# EAGLE design STEPDUINO (EAGLE 6.5.0)
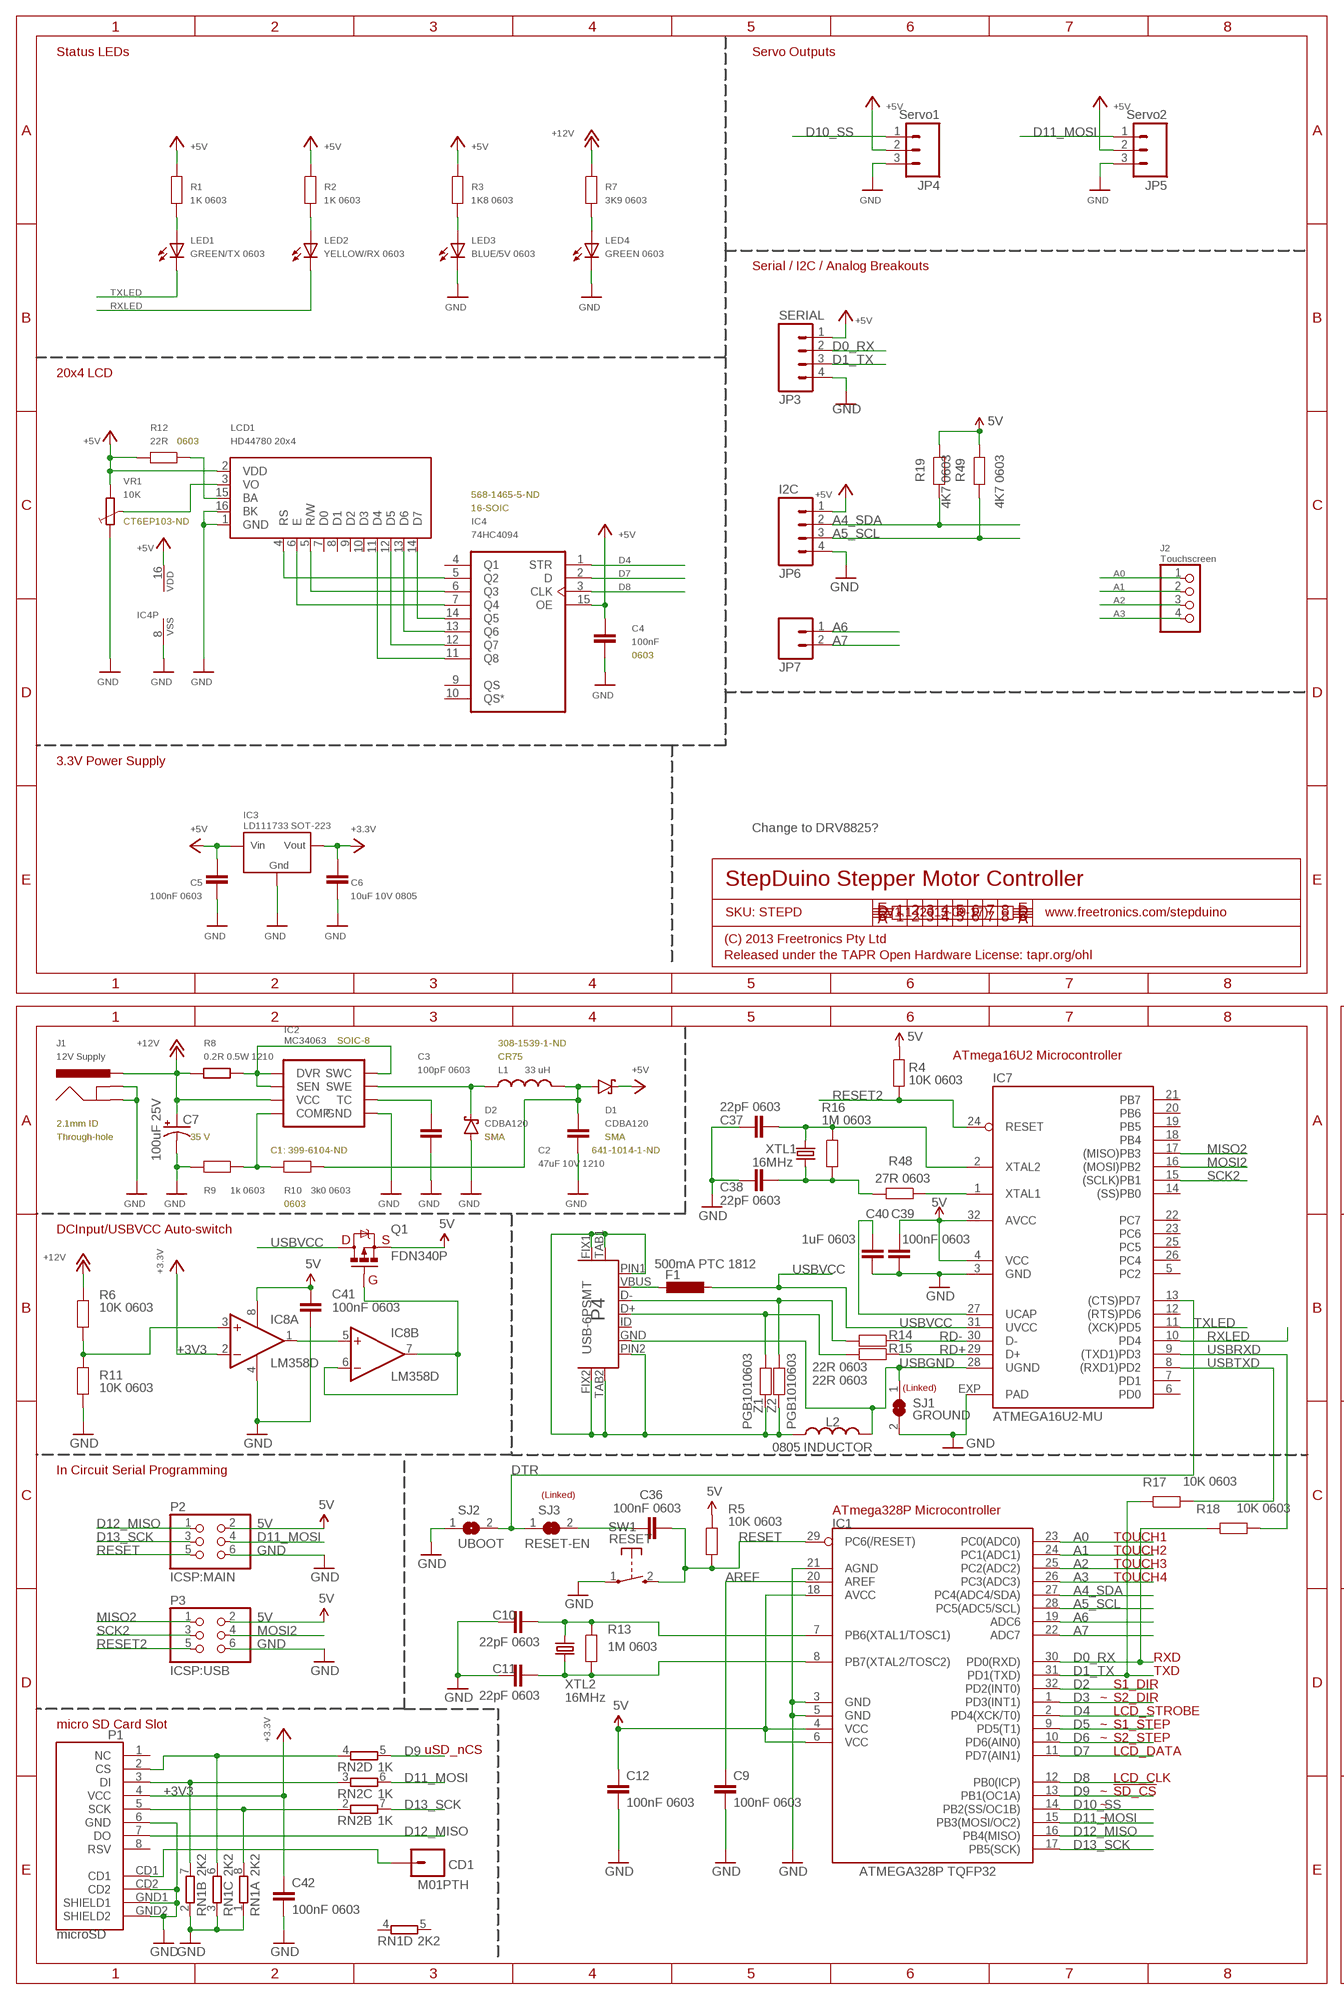
[diagram p0: schematic, sheet 1, part 1 of 2]
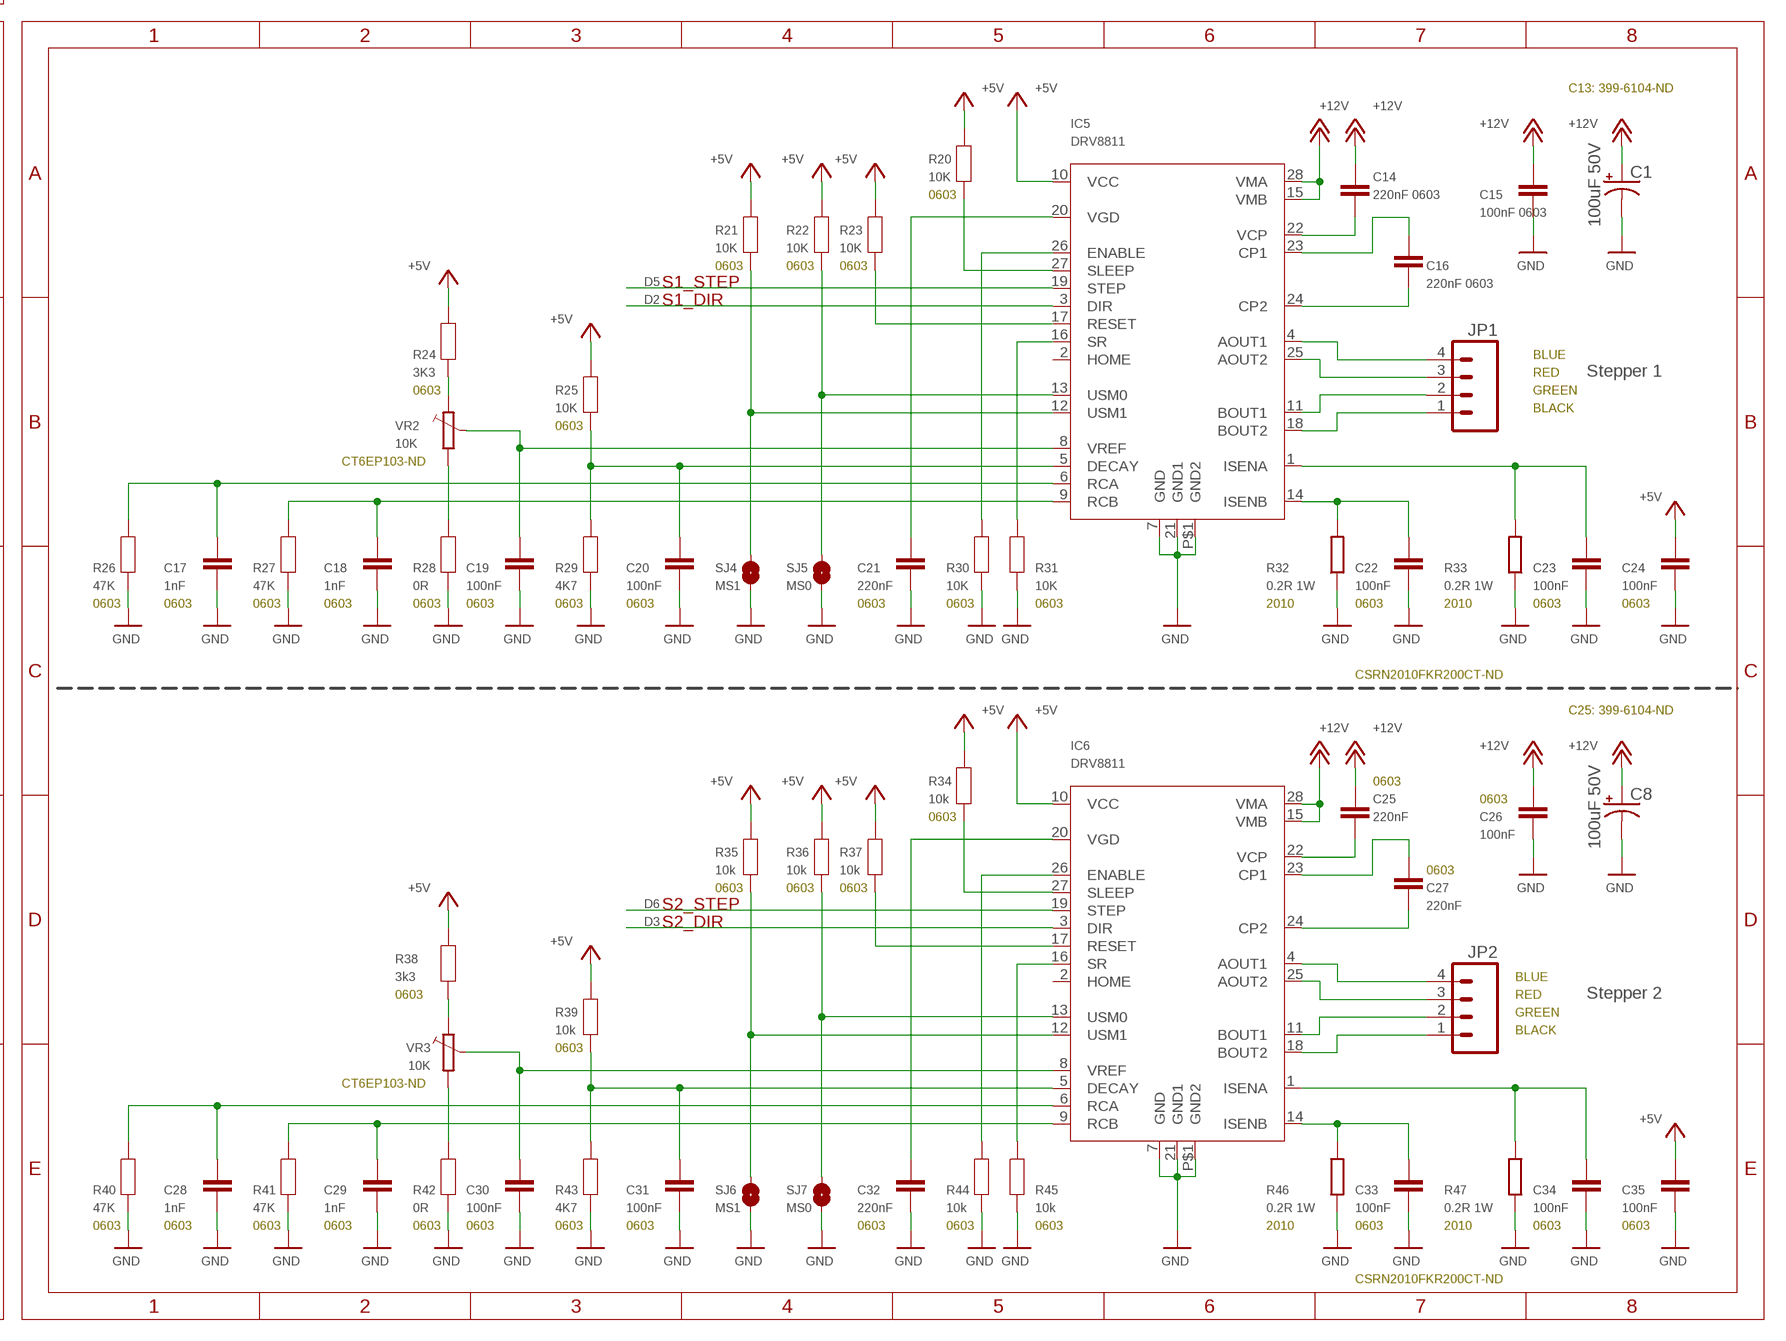
[diagram p1: schematic, sheet 1, part 2 of 2]

## Parts
C1  100uF 50V  CAP_POLE  [PANASONIC_E]
C2  47uF 10V 1210  C-EUC1210  [C1210]
C3  100pF 0603  CAP0603  [0603]
C4  100nF  CAP0603  [0603]
C5  100nF 0603  CAP0603  [0603]
C6  10uF 10V 0805  CAP0805  [0805]
C7  100uF 25V  CAP_POLE  [PANASONIC_E]
C8  100uF 50V  CAP_POLE  [PANASONIC_E]
C9  100nF 0603  CAP0603  [0603]
C10  22pF 0603  CAP0603  [0603]
C11  22pF 0603  CAP0603  [0603]
C12  100nF 0603  CAP0603  [0603]
C14  220nF 0603  CAP0603  [0603]
C15  100nF 0603  CAP0603  [0603]
C16  220nF 0603  CAP0603  [0603]
C17  1nF  CAP0603  [0603]
C18  1nF  CAP0603  [0603]
C19  100nF  CAP0603  [0603]
C20  100nF  CAP0603  [0603]
C21  220nF  CAP0603  [0603]
C22  100nF  CAP0603  [0603]
C23  100nF  CAP0603  [0603]
C24  100nF  CAP0603  [0603]
C25  220nF  CAP0603  [0603]
C26  100nF  CAP0603  [0603]
C27  220nF  CAP0603  [0603]
C28  1nF  CAP0603  [0603]
C29  1nF  CAP0603  [0603]
C30  100nF  CAP0603  [0603]
C31  100nF  CAP0603  [0603]
C32  220nF  CAP0603  [0603]
C33  100nF  CAP0603  [0603]
C34  100nF  CAP0603  [0603]
C35  100nF  CAP0603  [0603]
C36  100nF 0603  CAP0603  [0603]
C37  22pF 0603  CAP0603  [0603]
C38  22pF 0603  CAP0603  [0603]
C39  100nF 0603  CAP0603  [0603]
C40  1uF 0603  CAP0603  [0603]
C41  100nF 0603  CAP0603  [0603]
C42  100nF 0603  CAP0603  [0603]
CD1  M01PTH  [1X01]
D1  CDBA120  SCHOTTKY  [SMA]
D2  CDBA120  SCHOTTKY  [SMA]
F1  500mA PTC 1812  L-EUL1812  [L1812]
IC1  ATMEGA328P TQFP32  AVR-MEGA8-AI  [TQFP32-08]
IC2  MC34063  MC34063SMD  [SO08]
IC3  LD111733 SOT-223  REG1117  [SOT223]
IC4  74HC4094  4094D  [SO16@1]
IC5  DRV8811  [HTSSOP28]
IC6  DRV8811  [HTSSOP28]
IC7  ATMEGA16U2-MU  ATMEL_ATMEGA8U2-MUQFN  [ATMEL_QFN32]
IC8  LM358D  [SO08]
J1  12V Supply  POWER_JACKPTH  [POWER_JACK_PTH]
J2  Touchscreen  PINHD-1X4  [1X04]
JP1  M04SCREW  [SCREWTERMINAL-3.5MM-4]
JP2  M04SCREW  [SCREWTERMINAL-3.5MM-4]
JP3  SERIAL  M04PTH  [1X04]
JP4  Servo1  M03PTH  [1X03]
JP5  Servo2  M03PTH  [1X03]
JP6  I2C  M04PTH  [1X04]
JP7  M02PTH  [1X02]
L1  33 uH  INDUCTORCR75  [CR75]
L2  0805 INDUCTOR  INDUCTOR0805-LARGE  [0805-LARGE]
LCD1  HD44780 20x4  HDM20416L  [HDM20416L]
LED1  GREEN/TX 0603  LED0603  [LED-0603]
LED2  YELLOW/RX 0603  LED0603  [LED-0603]
LED3  BLUE/5V 0603  LED0603  [LED-0603]
LED4  GREEN 0603  LED0603  [LED-0603]
P1  microSD  USD-SOCKETNEW  [MICRO-SD-SOCKET-PP]
P2  ICSP:MAIN  PINHD-2X3  [2X03]
P3  ICSP:USB  PINHD-2X3  [2X03]
P4  USB-6PSMT  [USB-MICROB-MB05PMXX]
Q1  FDN340P  MOSFET-PCHANNEL  [SOT23]
R1  1K 0603  RESISTOR0603  [0603]
R2  1K 0603  RESISTOR0603  [0603]
R3  1K8 0603  RESISTOR0603  [0603]
R4  10K 0603  RESISTOR0603  [0603]
R5  10K 0603  RESISTOR0603  [0603]
R6  10K 0603  RESISTOR0603  [0603]
R7  3K9 0603  RESISTOR0603  [0603]
R8  0.2R 0.5W 1210  R-EU_R1210  [R1210]
R9  1k 0603  RESISTOR0603  [0603]
R10  3k0 0603  RESISTOR0603  [0603]
R11  10K 0603  RESISTOR0603  [0603]
R12  22R  RESISTOR0603  [0603]
R13  1M 0603  RESISTOR0603  [0603]
R14  22R 0603  RESISTOR0603  [0603]
R15  22R 0603  RESISTOR0603  [0603]
R16  1M 0603  RESISTOR0603  [0603]
R17  10K 0603  RESISTOR0603  [0603@1]
R18  10K 0603  RESISTOR0603  [0603@1]
R19  4K7 0603  RESISTOR0603  [0603]
R20  10K  RESISTOR0603  [0603]
R21  10K  RESISTOR0603  [0603]
R22  10K  RESISTOR0603  [0603]
R23  10K  RESISTOR0603  [0603]
R24  3K3  RESISTOR0603  [0603]
R25  10K  RESISTOR0603  [0603]
R26  47K  RESISTOR0603  [0603]
R27  47K  RESISTOR0603  [0603]
R28  0R  RESISTOR0603  [0603]
R29  4K7  RESISTOR0603  [0603]
R30  10K  RESISTOR0603  [0603]
R31  10K  RESISTOR0603  [0603]
R32  0.2R 1W  R-EU_R2010  [R2010]
R33  0.2R 1W  R-EU_R2010  [R2010]
R34  10k  RESISTOR0603  [0603]
R35  10k  RESISTOR0603  [0603]
R36  10k  RESISTOR0603  [0603]
R37  10k  RESISTOR0603  [0603]
R38  3k3  RESISTOR0603  [0603]
R39  10k  RESISTOR0603  [0603]
R40  47K  RESISTOR0603  [0603]
R41  47K  RESISTOR0603  [0603]
R42  0R  RESISTOR0603  [0603]
R43  4K7  RESISTOR0603  [0603]
R44  10k  RESISTOR0603  [0603]
R45  10k  RESISTOR0603  [0603]
R46  0.2R 1W  R-EU_R2010  [R2010]
R47  0.2R 1W  R-EU_R2010  [R2010]
R48  27R 0603  RESISTOR0603  [0603]
R49  4K7 0603  RESISTOR0603  [0603]
RN1  2K2  4R-NCAY16  [CAY16]
RN2  1K  4R-NCAY16  [CAY16]
SJ1  GROUND  SJCN  [SJC]
SJ2  UBOOT  SJ  [SJ]
SJ3  RESET-EN  SJCN  [SJC]
SJ4  MS1  SJ  [SJ]
SJ5  MS0  SJ  [SJ]
SJ6  MS1  SJ  [SJ]
SJ7  MS0  SJ  [SJ]
SW1  RESET  TAC_SWITCH_2PIN  [TACTILE_SWITCH_SMD_2PIN_TINY]
VR1  10K  TRIM_EU-CT6  [CT6]
VR2  10K  TRIM_EU-CT6  [CT6]
VR3  10K  TRIM_EU-CT6  [CT6]
XTL1  16MHz  CRYSTALHC49UV  [HC49U-V]
XTL2  16MHz  CRYSTALHC49UV  [HC49U-V]
Z1  PGB1010603  RESISTOR0603  [0603]
Z2  PGB1010603  RESISTOR0603  [0603]

## Nets
5V: C4.1 C5.1 C12.1 C24.1 C35.1 C39.1 C41.1 D1.K IC1.4(VCC) IC1.6(VCC) IC1.18(AVCC) IC3.3(VIN) IC4.15(OE) IC4.16(VDD) IC5.10(VCC) IC6.10(VCC) IC7.4(VCC) IC7.32(AVCC) IC8.8(P:V+) JP3.1 JP4.2 JP5.2 JP6.1 LCD1.2(VDD) P2.2 P3.2 Q1.2(S) R1.2 R2.2 R3.2 R4.2 R5.2 R12.2 R19.2 R20.2 R21.2 R22.2 R23.2 R24.2 R25.2 R34.2 R35.2 R36.2 R37.2 R38.2 R39.2 R49.2 VR1.A ; supply symbol labelled +5V
+3V3: C6.1 C42.1 IC3.2(VOUT) IC8.2(A:-IN) P1.4(VCC) ; supply symbol labelled +3.3V
+12V: C1.+ C7.+ C8.+ C14.1 C15.1 C25.1 C26.1 IC2.6(VCC) IC5.15(VMB) IC5.28(VMA) IC6.15(VMB) IC6.28(VMA) J1.PWR R6.2 R7.2 R8.1
A0: IC1.23(PC0(ADC0)) J2.1
A1: IC1.24(PC1(ADC1)) J2.2
A2: IC1.25(PC2(ADC2)) J2.3
A3: IC1.26(PC3(ADC3)) J2.4
A4_SDA: IC1.27(PC4(ADC4/SDA)) JP6.2 R19.1
A5_SCL: IC1.28(PC5(ADC5/SCL)) JP6.3 R49.1
A6: IC1.19(ADC6) JP7.1
A7: IC1.22(ADC7) JP7.2
AREF: C9.1 IC1.20(AREF)
D0_RX: IC1.30(PD0(RXD)) JP3.2 R18.1
D1_TX: IC1.31(PD1(TXD)) JP3.3 R17.1
D2: IC1.32(PD2(INT0)) IC5.3(DIR)
D3: IC1.1(PD3(INT1)) IC6.3(DIR)
D4: IC1.2(PD4(XCK/T0)) IC4.1(STR)
D5: IC1.9(PD5(T1)) IC5.19(STEP)
D6: IC1.10(PD6(AIN0)) IC6.19(STEP)
D7: IC1.11(PD7(AIN1)) IC4.2(D)
D8: IC1.12(PB0(ICP)) IC4.3(CLK)
D9: IC1.13(PB1(OC1A)) RN2.5
D10_SS: IC1.14(PB2(SS/OC1B)) JP4.1
D11_MOSI: IC1.15(PB3(MOSI/OC2)) JP5.1 P2.4 RN2.6
D12_MISO: IC1.16(PB4(MISO)) P1.7(DO) P2.1
D13_SCK: IC1.17(PB5(SCK)) P2.3 RN2.7
DTR: IC7.13((CTS)PD7) SJ2.2 SJ3.1
GND: C1.- C2.2 C3.2 C4.2 C5.2 C6.2 C7.- C8.- C9.2 C10.1 C11.1 C12.2 C15.2 C17.2 C18.2 C19.2 C20.2 C21.2 C22.2 C23.2 C24.2 C26.2 C28.2 C29.2 C30.2 C31.2 C32.2 C33.2 C34.2 C35.2 C37.1 C38.1 C39.2 C40.2 C41.2 C42.2 D2.A IC1.3(GND) IC1.5(GND) IC1.21(AGND) IC2.4(GND) IC3.1(GND) IC4.8(VSS) IC5.7(GND) IC5.21(GND1) IC5.P$1(GND2) IC6.7(GND) IC6.21(GND1) IC6.P$1(GND2) IC7.3(GND) IC7.EXP(PAD) IC8.4(P:V-) J1.GND J1.GNDBREAK JP3.4 JP4.3 JP5.3 JP6.4 LCD1.1(GND) LCD1.16(BK) LED3.C LED4.C P1.6(GND) P1.CD2 P1.GND1(SHIELD1) P1.GND2(SHIELD2) P2.6 P3.6 R9.2 R11.1 R26.1 R27.1 R28.1 R29.1 R30.1 R31.1 R32.1 R33.1 R40.1 R41.1 R42.1 R43.1 R44.1 R45.1 R46.1 R47.1 RN1.1 RN1.2 RN1.3 SJ1.2 SJ2.1 SJ4.1 SJ5.1 SJ6.1 SJ7.1 SW1.1(P) VR1.E
MISO2: IC7.17((MISO)PB3) P3.1
MOSI2: IC7.16((MOSI)PB2) P3.4
N$1: IC6.11(BOUT1) JP2.2
N$3: IC5.4(AOUT1) JP1.4
N$4: IC6.18(BOUT2) JP2.1
N$6: IC6.25(AOUT2) JP2.3
N$7: C27.2 IC6.24(CP2)
N$8: C27.1 IC6.23(CP1)
N$9: C25.2 IC6.22(VCP)
N$10: C32.1 IC6.20(VGD)
N$11: C10.2 IC1.7(PB6(XTAL1/TOSC1)) R13.2 XTL2.2
N$13: C34.1 IC6.1(ISENA) R47.2
N$14: C33.1 IC6.14(ISENB) R46.2
N$15: C31.1 IC6.5(DECAY) R39.1 R43.2
N$16: C28.1 IC6.6(RCA) R40.2
N$17: C16.2 IC5.24(CP2)
N$18: C16.1 IC5.23(CP1)
N$19: IC5.16(SR) R31.2
N$20: C29.1 IC6.9(RCB) R41.2
N$21: IC5.18(BOUT2) JP1.1
N$22: IC5.11(BOUT1) JP1.2
N$23: IC5.25(AOUT2) JP1.3
N$24: C14.2 IC5.22(VCP)
N$25: C20.1 IC5.5(DECAY) R25.1 R29.2
N$26: C21.1 IC5.20(VGD)
N$27: C17.1 IC5.6(RCA) R26.2
N$28: C11.2 IC1.8(PB7(XTAL2/TOSC2)) R13.1 XTL2.1
N$29: LED3.A R3.1
N$30: LED2.A R2.1
N$31: LED1.A R1.1
N$32: IC2.1(SWC) IC2.7(SEN) IC2.8(DVR) R8.2
N$36: IC7.1(XTAL1) R48.1
N$37: L2.1 P4.FIX1 P4.FIX2 P4.PIN1 P4.PIN2 P4.TAB1 P4.TAB2 Z1.2 Z2.2
N$38: P4.D+ R15.2 Z1.1
N$40: P4.D- R14.2 Z2.1
N$42: LED4.A R7.1
N$43: C3.1 IC2.3(TC)
N$44: IC2.5(COMP) R9.1 R10.2
N$45: D2.K IC2.2(SWE) L1.P$1
N$46: C23.1 IC5.1(ISENA) R33.2
N$47: C22.1 IC5.14(ISENB) R32.2
N$48: C18.1 IC5.9(RCB) R27.2
N$49: IC5.27(SLEEP) R20.1
N$50: IC4.5(Q2) LCD1.4(RS)
N$51: IC4.6(Q3) LCD1.5(R/W)
N$52: IC4.7(Q4) LCD1.6(E)
N$53: IC4.11(Q8) LCD1.11(D4)
N$54: IC4.12(Q7) LCD1.12(D5)
N$55: IC4.13(Q6) LCD1.13(D6)
N$56: IC4.14(Q5) LCD1.14(D7)
N$57: IC5.17(RESET) R23.1
N$58: LCD1.3(VO) VR1.S
N$59: LCD1.15(BA) R12.1
N$60: R24.1 VR2.E
N$61: R28.2 VR2.A
N$62: IC8.3(A:+IN) R6.1 R11.2
N$63: IC8.6(B:-IN) IC8.7(B:OUT) Q1.1(G)
N$64: C19.1 IC5.8(VREF) VR2.S
N$65: IC5.26(ENABLE) R30.2
N$66: IC5.12(USM1) R21.1 SJ4.2
N$67: IC5.13(USM0) R22.1 SJ5.2
N$68: IC6.27(SLEEP) R34.1
N$69: IC6.17(RESET) R37.1
N$70: R38.1 VR3.E
N$71: R42.2 VR3.A
N$72: C30.1 IC6.8(VREF) VR3.S
N$73: IC6.26(ENABLE) R44.2
N$74: IC6.12(USM1) R35.1 SJ6.2
N$75: IC6.13(USM0) R36.1 SJ7.2
N$76: IC6.16(SR) R45.2
N$77: IC6.4(AOUT1) JP2.4
N$81: IC8.1(A:OUT) IC8.5(B:+IN)
N$82: P1.2(CS) RN1.6 RN2.4
N$83: P1.3(DI) RN1.7 RN2.3
N$84: P1.5(SCK) RN1.8 RN2.2
N$87: CD1.1 P1.CD1
N$90: C36.1 SJ3.2
N$113: C37.2 IC7.2(XTAL2) R16.2 XTL1.2
N$114: C38.2 R16.1 R48.2 XTL1.1
N$115: F1.1 P4.VBUS
N$117: C40.1 IC7.27(UCAP)
RD+: IC7.29(D+) R15.1
RD-: IC7.30(D-) R14.1
REG_5V: C2.1 D1.A L1.P$2 R10.1
RESET: C36.2 IC1.29(PC6(/RESET)) P2.5 R5.1 SW1.2(S)
RESET2: IC7.24(RESET) P3.5 R4.1
RXLED: IC7.10(PD4) LED2.C
SCK2: IC7.15((SCLK)PB1) P3.3
TXLED: IC7.11((XCK)PD5) LED1.C
USBGND: IC7.28(UGND) L2.2 P4.GND SJ1.1
USBRXD: IC7.9((TXD1)PD3) R18.2
USBTXD: IC7.8((RXD1)PD2) R17.2
USBVCC: F1.2 IC7.31(UVCC) Q1.3(D)
Unconnected: IC4.4(Q1) IC4.9(QS) IC4.10(QS*) IC5.2(HOME) IC6.2(HOME) IC7.5(PC2) IC7.6(PD0) IC7.7(PD1) IC7.12((RTS)PD6) IC7.14((SS)PB0) IC7.18(PB4) IC7.19(PB5) IC7.20(PB6) IC7.21(PB7) IC7.22(PC7) IC7.23(PC6) IC7.25(PC5) IC7.26(PC4) LCD1.7(D0) LCD1.8(D1) LCD1.9(D2) LCD1.10(D3) P1.1(NC) P1.8(RSV) P4.ID RN1.4 RN1.5 RN2.1 RN2.8

## Notes on the sheet
- Status LEDs | Servo Outputs
- Serial / I2C / Analog Breakouts
- 20x4 LCD
- 0603
- 568-1465-5-ND
- 16-SOIC
- CT6EP103-ND
- 0603
- 3.3V Power Supply
- Change to DRV8825?
- StepDuino Stepper Motor Controller
- SKU: STEPD | V1.1 (2013-09-17) | www.freetronics.com/stepduino
- (C) 2013 Freetronics Pty Ltd
- Released under the TAPR Open Hardware License: tapr.org/ohl
- SOIC-8 | 308-1539-1-ND
- CR75 | ATmega16U2 Microcontroller | C13: 399-6104-ND
- 2.1mm ID
- Through-hole | 35 V | SMA | SMA | 0603
- C1: 399-6104-ND | 641-1014-1-ND
- 0603 | 0603 | 0603
- 0603 | S1_STEP
- S1_DIR
- DCInput/USBVCC Auto-switch
- D | S
- BLUE
- RED | Stepper 1
- G | 0603 | GREEN
- BLACK
- 0603
- CT6EP103-ND
- (Linked)
- 0603 | 0603 | 0603 | 0603 | 0603 | 0603 | 0603 | 0603 | 0603 | 0603 | 0603 | 2010 | 0603 | 2010 | 0603 | 0603
- In Circuit Serial Programming
- (Linked)
- CSRN2010FKR200CT-ND
- ATmega328P Microcontroller
- C25: 399-6104-ND
- TOUCH1
- TOUCH2
- TOUCH3
- TOUCH4 | 0603
- 0603
- 0603
- 0603
- RXD | 0603 | 0603 | 0603
- TXD | S2_STEP
- S1_DIR | S2_DIR
- ~ | S2_DIR
- LCD_STROBE
- micro SD Card Slot | ~ | S1_STEP | BLUE
- ~ | S2_STEP | 0603 | RED | Stepper 2
- uSD_nCS | LCD_DATA | GREEN
- BLACK
- LCD_CLK | 0603
- ~ | !SD_CS
- ~ | CT6EP103-ND
- ~
- 0603 | 0603 | 0603 | 0603 | 0603 | 0603 | 0603 | 0603 | 0603 | 0603 | 0603 | 2010 | 0603 | 2010 | 0603 | 0603
- CSRN2010FKR200CT-ND

## Library data of the parts
C1 C7 C8 = freetronics-original:CAP_POL: Capacitor Polarized These are standard SMD and PTH capacitors. Normally 10uF, 47uF, and 100uF in electrolytic and tantalum varieties. Always verify the external diameter of the through hole cap, it varies with capacity, voltage, and manufacturer. The EIA devices should be standard.
C2 = rcl:C-EU: CAPACITOR, European symbol
C3-C6 C14-C35 = freetronics-master-v1:CAP: Capacitor Standard 0603 ceramic capacitor, and 0.1" leaded capacitor.
C9-C12 C36-C42 = freetronics-master-v1.1:CAP: Capacitor Standard 0603 ceramic capacitor, and 0.1" leaded capacitor.
CD1 = freetronics-2:M01: Header 1 Standard 1-pin 0.1" header. Use with straight break away headers (SKU : PRT-00116), right angle break away headers (PRT-00553), swiss pins (PRT-00743), machine pins (PRT-00117), and female headers (PRT-00115).
D1 D2 = freetronics-luke:SCHOTTKY
F1 = rcl:L-EU: INDUCTOR, European symbol
IC1 = freetronics-2:AVR-MEGA8: MICROCONTROLLER 8 Kbytes FLASH 1 kbytes SRAM 512 bytes EEPROM USART 6-channel 10 bit ADC 2-channel 8 bit ADC
IC2 = SparkFun:MC34063
IC3 = burr-brown:REG1117: 800mA and 1A Low Dropout (LDO) Positive Regulator 1.8V, 2.5V, 2.85V, 3.3V, 5V, and Adj; MPN: REG1117; OC_FARNELL: 1097566; OC_NEWARK: 14P6981
IC4 = 40xx:4094: 8-stage SHIFT/STORE REGISTER, tri-state
IC5 IC6 = eje-components:DRV8811
IC7 = freetronics-jon:ATMEL_ATMEGA8U2-MU
IC8 = linear:LM358: OP AMP also LM158; LM258; LM2904 Source: http://cache.national.com/ds/LM/LM158.pdf
J1 = freetronics-master-v1.1:POWER_JACK: Power Jack This is the standard 5.5mm barrel jack for power. The PTH is the most common, proven, reliable, footprint. All others are experimental. The Slot footprint only works if the mill layer is transmitted to the PCB fab house so be warned. Spark Fun Electronics SKU : PRT-00119. Mating wall wart : TOL-00298 (and others)
J2 = pinhead:PINHD-1X4: PIN HEADER
JP1-JP3 JP6 = freetronics-master-v1:M04: Header 4 Standard 4-pin 0.1" header. Use with straight break away headers (SKU : PRT-00116), right angle break away headers (PRT-00553), swiss pins (PRT-00743), machine pins (PRT-00117), and female headers (PRT-00115). Molex polarized connector foot print use with SKU : PRT-08231 with associated crimp pins and housings.
JP4 JP5 = freetronics-master-v1.1:M03: Header 3 Standard 3-pin 0.1" header. Use with straight break away headers (SKU : PRT-00116), right angle break away headers (PRT-00553), swiss pins (PRT-00743), machine pins (PRT-00117), and female headers (PRT-00115). Molex polarized connector foot print use with SKU : PRT-08232 with associated crimp pins and housings.
JP7 = freetronics-master-v1.1:M02: Header 2 Standard 2-pin 0.1" header. Use with straight break away headers (SKU : PRT-00116), right angle break away headers (PRT-00553), swiss pins (PRT-00743), machine pins (PRT-00117), and female headers (PRT-00115). Molex polarized connector foot print use with SKU : PRT-08233 with associated crimp pins and housings.
L1 = SparkFun:INDUCTOR: Inductors Basic Inductor/Choke - 0603 and 1206. Footprints are not proven and vary greatly between part numbers.
L2 = freetronics-master-v1:INDUCTOR: Inductors Basic Inductor/Choke - 0603 and 1206. Footprints are not proven and vary greatly between part numbers.
LCD1 = abi-lcd:HDM20416L
LED1-LED4 = freetronics-master-v1:LED: LEDs Standard schematic elements and footprints for 5mm, 3mm, 1206, and 0603 sized LEDs. 5mm - Spark Fun Electronics SKU : COM-00529 (and others)
P1 = freetronics-master-v1:USD-SOCKET: microSD Socket Push-push type uSD socket. Schematic element and footprint production proven. Spark Fun Electronics SKU : PRT-00127. tDoc lines correctly indicate media card edge positions when inserting (unlocked, locked, depressed).
P2 P3 = pinhead:PINHD-2X3: PIN HEADER
P4 = freetronics-jon:USB-6P
Q1 = freetronics-master-v1:MOSFET-PCHANNEL
R1-R7 R11 R13-R16 R19 R48 R49 Z1 Z2 = freetronics-master-v1.1:RESISTOR: Resistor Basic schematic elements and footprints for 0603, 1206, and PTH 1/10th watt (small) resistors.
R8 R32 R33 R46 R47 = rcl:R-EU_: RESISTOR, European symbol
R9 R10 R12 R20-R31 R34-R45 = freetronics-master-v1:RESISTOR: Resistor Basic schematic elements and footprints for 0603, 1206, and PTH 1/10th watt (small) resistors.
R17 R18 = freetronics:RESISTOR: Resistor Basic schematic elements and footprints for 0603, 1206, and PTH 1/10th watt (small) resistors.
RN1 RN2 = freetronics-master-v1:4R-N: Array Chip Resistor Source: RS Component / Phycomp
SJ1 SJ3 = freetronics-jon:SJC
SJ2 = jumper:SJ: SMD solder JUMPER
SJ4-SJ7 = freetronics-luke:SJ: PCB "solder jumper". Note that there should nothing on the BOM corresponding to this "component".
SW1 = freetronics-master-v1:TAC_SWITCH_2PIN: Momentary Tactile Switch - 2 pin
VR1-VR3 = pot:TRIM_EU-: POTENTIOMETER
XTL1 XTL2 = freetronics-master-v1:CRYSTAL: Crystals Various standard crystals. Proven footprints. Spark Fun Electronics SKU : COM-00534

## Board
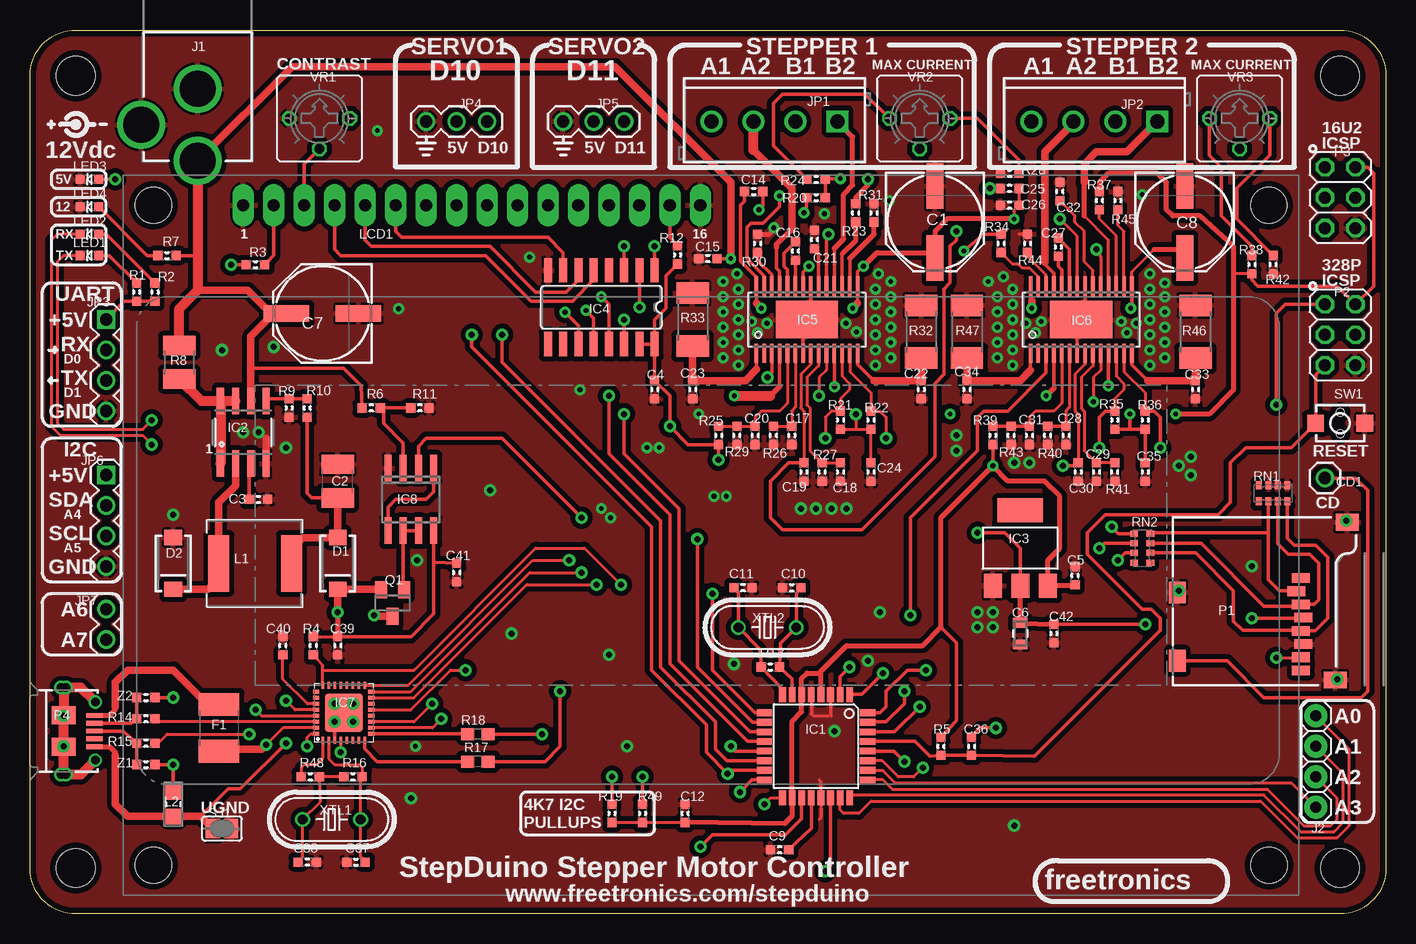
[diagram p2: board, top side]
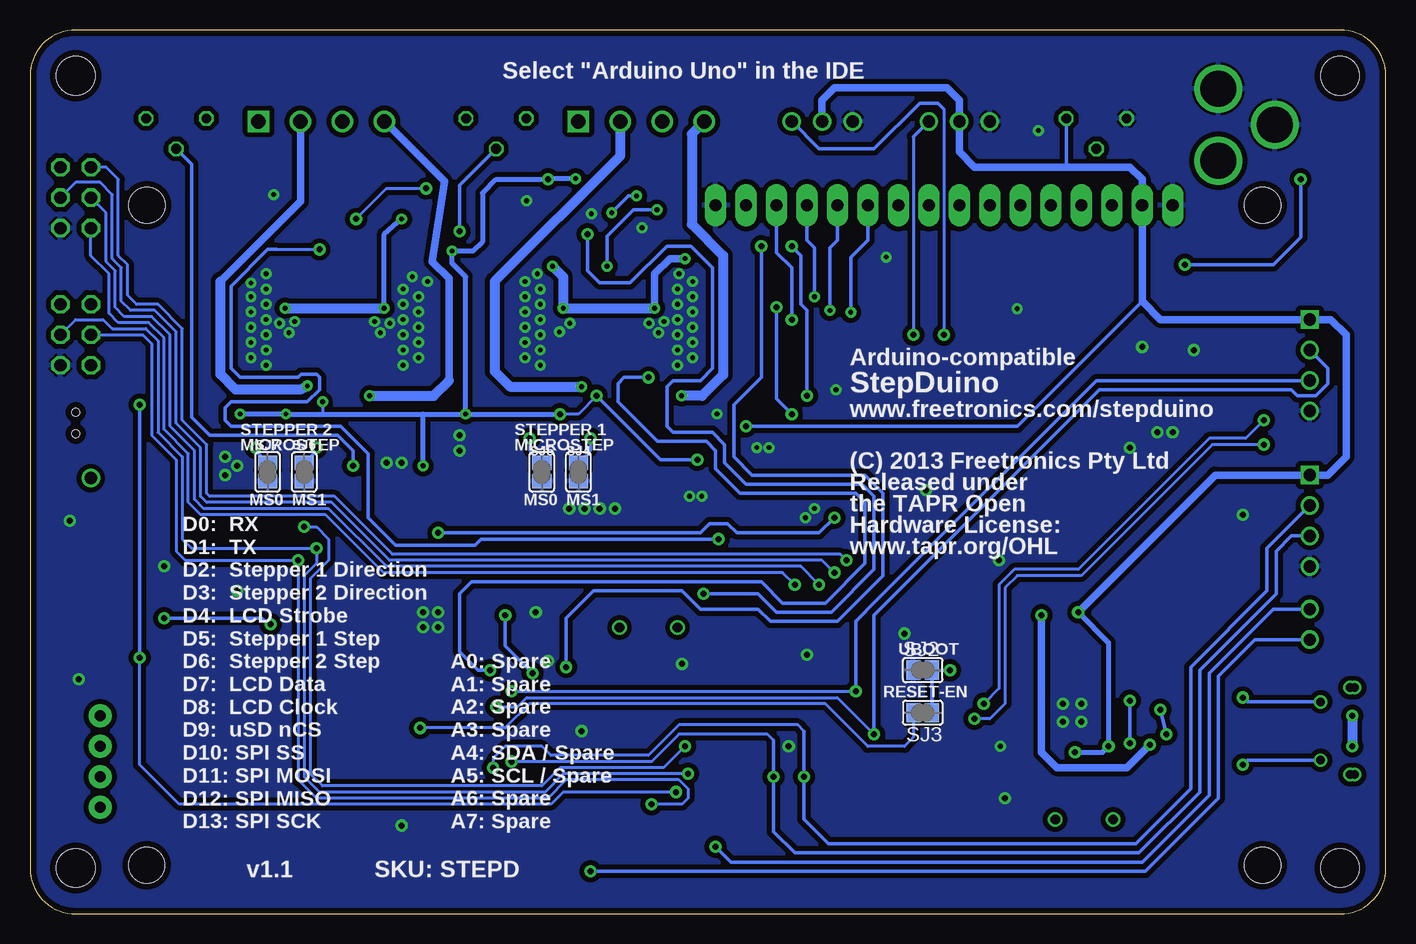
[diagram p3: board, bottom side, seen from below]

Size 113.03 x 73.66 mm. Coordinates in mm from the lower left corner, seen from the top.
Outline: 0,69.85 arc-90 3.81,73.66 109.22,73.66 arc-90 113.03,69.85 113.03,3.81 arc-90 109.22,0 3.81,0 arc-90 0,3.81 0,69.85
Copper layers (1*16): Top 0.035mm / dielectric 1.5mm / Bottom 0.035mm
Design rules "default": minimum track width 8mil, minimum drill 0.4mm, track to track 8mil, track to pad 8mil, pad to pad 8mil, via to via 8mil, smd to smd 8mil, copper to edge 20mil, drill to drill 8mil, minimum pad ring 8mil, minimum via ring 10mil, stop-mask expansion 3mil, vias tented up to drill 25mil, thermal gap 8mil
Holes 3.2 mm at 109.22,69.85 3.81,69.85 109.22,3.81 3.81,3.81

### Footprints (pad centres in the part's own frame; a part is rotated, then mirrored left to right if it is on the bottom)
PANASONIC_E = smd 3.8 x 1.4: + 3,0; - -3,0
C1210 = smd 1.6 x 2.7: 1 -1.4,0; 2 1.4,0
0603 = smd 0.762 x 0.762: 1 -0.762,0; 2 0.762,0
0805 = smd 0.8 x 1.2: 1 -0.9,0; 2 0.9,0
1X01 = drill 1.016: 1 0,0
SMA = smd 1.27 x 1.47: A -2.15,0; K 2.15,0
L1812 = smd 1.9 x 3.4: 1 -1.95,0; 2 1.95,0
TQFP32-08 = smd 1.27 x 0.559: 1 -4.293,2.8; 2 -4.293,2; 3 -4.293,1.2; 4 -4.293,0.4; 5 -4.293,-0.4; 6 -4.293,-1.2; 7 -4.293,-2; 8 -4.293,-2.8; 17 4.293,-2.8; 18 4.293,-2; 19 4.293,-1.2; 20 4.293,-0.4; 21 4.293,0.4; 22 4.293,1.2; 23 4.293,2; 24 4.293,2.8 | smd 0.559 x 1.27: 9 -2.8,-4.293; 10 -2,-4.293; 11 -1.2,-4.293; 12 -0.4,-4.293; 13 0.4,-4.293; 14 1.2,-4.293; 15 2,-4.293; 16 2.8,-4.293; 25 2.8,4.293; 26 2,4.293; 27 1.2,4.293; 28 0.4,4.293; 29 -0.4,4.293; 30 -1.2,4.293; 31 -2,4.293; 32 -2.8,4.293
SO08 = smd 0.61 x 2.21: 1 -1.905,-2.616; 2 -0.635,-2.616; 3 0.635,-2.616; 4 1.905,-2.616; 5 1.905,2.616; 6 0.635,2.616; 7 -0.635,2.616; 8 -1.905,2.616
SOT223 = smd 1.499 x 2.007: 1 -2.261,-3.15; 2 0.025,-3.15; 3 2.311,-3.15 | smd 3.81 x 2.007: 4 0,3.15
SO16@1 = smd 0.66 x 2.032: 1 -4.445,-3.073; 2 -3.175,-3.073; 3 -1.905,-3.073; 4 -0.635,-3.073; 5 0.635,-3.073; 6 1.905,-3.073; 7 3.175,-3.073; 8 4.445,-3.073; 9 4.445,3.073; 10 3.175,3.073; 11 1.905,3.073; 12 0.635,3.073; 13 -0.635,3.073; 14 -1.905,3.073; 15 -3.175,3.073; 16 -4.445,3.073
HTSSOP28 = smd 0.3 x 1.6: 1 -4.225,-2.8; 2 -3.575,-2.8; 3 -2.925,-2.8; 4 -2.275,-2.8; 5 -1.625,-2.8; 6 -0.975,-2.8; 7 -0.325,-2.8; 8 0.325,-2.8; 9 0.975,-2.8; 10 1.625,-2.8; 11 2.275,-2.8; 12 2.925,-2.8; 13 3.575,-2.8; 14 4.225,-2.8; 15 4.225,2.8; 16 3.575,2.8; 17 2.925,2.8; 18 2.275,2.8; 19 1.625,2.8; 20 0.975,2.8; 21 0.325,2.8; 22 -0.325,2.8; 23 -0.975,2.8; 24 -1.625,2.8; 25 -2.275,2.8; 26 -2.925,2.8; 27 -3.575,2.8; 28 -4.225,2.8 | smd 5.18 x 3.1: P$1 0,0
ATMEL_QFN32 = smd 0.6 x 0.3: 1 -2.3,1.75; 2 -2.3,1.25; 3 -2.3,0.75; 4 -2.3,0.25; 5 -2.3,-0.25; 6 -2.3,-0.75; 7 -2.3,-1.25; 8 -2.3,-1.75; 17 2.3,-1.75; 18 2.3,-1.25; 19 2.3,-0.75; 20 2.3,-0.25; 21 2.3,0.25; 22 2.3,0.75; 23 2.3,1.25; 24 2.3,1.75 | smd 0.3 x 0.6: 9 -1.75,-2.3; 10 -1.25,-2.3; 11 -0.75,-2.3; 12 -0.25,-2.3; 13 0.25,-2.3; 14 0.75,-2.3; 15 1.25,-2.3; 16 1.75,-2.3; 25 1.75,2.3; 26 1.25,2.3; 27 0.75,2.3; 28 0.25,2.3; 29 -0.25,2.3; 30 -0.75,2.3; 31 -1.25,2.3; 32 -1.75,2.3 | smd 3.2 x 3.2: EXP 0,0
SO08' = smd 0.6 x 2.2: 1 -1.905,-2.6; 2 -0.635,-2.6; 3 0.635,-2.6; 4 1.905,-2.6; 5 1.905,2.6; 6 0.635,2.6; 7 -0.635,2.6; 8 -1.905,2.6
POWER_JACK_PTH = drill 2.997: GND 0,7.7; GNDBREAK 4.7,10.7; PWR 0,13.7
1X04 = drill 0.9 pad 1.93: 1 -3.81,0; 2 -1.27,0; 3 1.27,0; 4 3.81,0
SCREWTERMINAL-3.5MM-4 = drill 1.2 square: 1 0,0 | drill 1.2: 2 3.5,0; 3 7,0; 4 10.5,0
1X04' = drill 1.016 square: 1 0,0 | drill 1.016: 2 2.54,0; 3 5.08,0; 4 7.62,0
1X03 = drill 1.016: 1 0,0; 2 2.54,0; 3 5.08,0
1X02 = drill 1.016: 1 0,0; 2 2.54,0
CR75 = smd 1.75 x 4.7: P$1 0,0; P$2 6.05,0
0805-LARGE = smd 1.27 x 1.27: 1 -1.016,0; 2 1.016,0
HDM20416L = drill 1.016 pad 1.778 long: 1 -38.105,27.947; 2 -35.565,27.947; 3 -33.025,27.947; 4 -30.485,27.947; 5 -27.945,27.947; 6 -25.405,27.947; 7 -22.865,27.947; 8 -20.325,27.947; 9 -17.785,27.947; 10 -15.245,27.947; 11 -12.705,27.947; 12 -10.165,27.947; 13 -7.625,27.947; 14 -5.085,27.947; 15 -2.545,27.947; 16 -0.005,27.947 | hole 3: -45.593,27.94; -45.593,-27.064; 47.409,-27.064; 47.396,27.94
LED-0603 = smd 0.762 x 0.762: A -0.762,0; C 0.762,0
MICRO-SD-SOCKET-PP = smd 0.8 x 1.5: 1 -8.94,10.7; 2 -7.84,10.3; 3 -6.74,10.7; 4 -5.64,10.9; 5 -4.54,10.7; 6 -3.44,10.9; 7 -2.34,10.7; 8 -1.24,10.7 | smd 1.8 x 1.4: CD1 -2.05,0.4; CD2 -7.75,0.4 | smd 1.4 x 1.9: GND1 -0.45,13.55; GND2 -13.6,14.55
2X03 = drill 1.016 octagon: 1 -2.54,-1.27; 2 -2.54,1.27; 3 0,-1.27; 4 0,1.27; 5 2.54,-1.27; 6 2.54,1.27
USB-MICROB-MB05PMXX = smd 0.4 x 1.35: D+ 0,2.575; D- -0.65,2.575; GND 1.3,2.575; ID 0.65,2.575; VBUS -1.3,2.575 | smd 1.5 x 2: FIX1 -1.3,0; FIX2 1.3,0 | drill 0.7: PIN1 -2.425,2.65; PIN2 2.425,2.65; SLOT1 -3.625,-0.2; SLOT2 3.625,-0.2; TAB1 -3.625,0.2; TAB2 3.625,0.2
SOT23 = smd 1 x 1.4: 1 -0.95,-1.1; 2 0.95,-1.1; 3 0,1.1
R1210 = smd 1.6 x 2.7: 1 -1.4,0; 2 1.4,0
0603@1 = smd 1.1 x 1: 1 -0.85,0; 2 0.85,0
R2010 = smd 1.8 x 2.7: 1 -2.2,0; 2 2.2,0
CAY16 = smd 0.5 x 0.65: 1 -1.2,-0.675; 2 -0.4,-0.675; 3 0.4,-0.675; 4 1.2,-0.675; 5 1.2,0.675; 6 0.4,0.675; 7 -0.4,0.675; 8 -1.2,0.675
SJC = smd 1.168 x 1.6: 1 -0.762,0; 2 0.762,0
SJ = smd 1.168 x 1.6: 1 -0.762,0; 2 0.762,0
TACTILE_SWITCH_SMD_2PIN_TINY = smd 1.4 x 1.4: 1 -2.05,0; 2 2.05,0 | hole 0.65: 0,0.9; 0,-0.9
CT6 = drill 0.813 octagon: A 2.515,0; E -2.515,0; S 0,-2.54
HC49U-V = drill 0.813: 1 -2.413,0; 2 2.413,0

### Placement (x,y rotation side)
C1  75.44,57.66 270 top
C2  25.65,36.07 90 top
C3  19.05,34.54 0 top
C4  52.07,43.69 270 top
C5  87.12,28.19 90 top
C6  82.55,23.37 270 top
C7  24.38,50.04 180 top
C8  96.27,57.66 270 top
C9  62.48,5.33 180 top
C10  63.5,27.18 0 top
C11  59.44,27.18 180 top
C12  54.61,8.38 90 top
C14  60.33,60.2 0 top
C15  56.52,54.61 180 top
C16  63.82,55.24 90 top
C17  63.5,39.88 270 top
C18  67.56,36.83 270 top
C19  64.52,36.83 270 top
C20  60.45,39.88 270 top
C21  65.41,56.2 90 top
C22  74.3,43.69 270 top
C23  55.24,43.69 270 top
C24  70.1,36.83 270 top
C25  81.66,60.45 180 top
C26  81.66,59.05 180 top
C27  85.72,55.56 270 top
C28  86.36,39.88 270 top
C29  88.9,36.83 270 top
C30  87.38,36.83 270 top
C31  83.31,39.88 270 top
C32  85.85,60.2 90 top
C33  97.16,43.69 270 top
C34  78.11,43.69 270 top
C35  92.96,36.83 270 top
C36  78.49,13.97 270 top
C37  27.18,4.32 0 top
C38  23.11,4.32 180 top
C39  25.65,22.35 270 top
C40  21.08,22.35 90 top
C41  35.56,28.45 270 top
C42  85.34,23.37 270 top
CD1  107.95,36.32 0 top
D1  25.65,29.21 270 top
D2  11.94,29.21 270 top
F1  15.75,15.49 270 top
IC1  65.53,13.97 270 top
IC2  17.78,40.13 0 top
IC3  82.55,30.48 0 top
IC4  47.62,50.56 180 top
IC5  64.77,49.53 0 top
IC6  87.63,49.53 0 top
IC7  26.16,16.76 90 top
IC8  LM358D  [SO08']  31.75,34.54 180 top
J1  13.97,76.45 180 top
J2  107.19,12.7 270 top
JP1  67.31,66.04 180 top
JP2  93.98,66.04 180 top
JP3  SERIAL  [1X04']  6.35,49.53 270 top
JP4  38.1,66.04 180 top
JP5  49.53,66.04 180 top
JP6  I2C  [1X04']  6.35,36.58 270 top
JP7  6.35,25.4 270 top
L1  15.75,29.21 0 top
L2  11.94,9.14 270 top
LCD1  55.88,31.11 0 top
LED1  4.95,54.86 180 top
LED2  4.95,56.64 180 top
LED3  4.95,61.21 180 top
LED4  4.95,58.93 180 top
P1  95.25,19.05 270 top
P2  109.22,48.26 270 top
P3  109.22,59.69 270 top
P4  2.79,15.24 270 top
Q1  30.23,25.91 180 top
R1  8.89,51.82 270 top
R2  10.41,51.82 270 top
R3  18.8,54.1 0 top
R4  23.62,22.35 90 top
R5  75.95,13.97 90 top
R6  28.45,42.16 180 top
R7  11.43,54.86 0 top
R8  12.45,45.97 270 top
R9  21.59,42.16 270 top
R10  23.11,42.16 90 top
R11  32.51,42.16 180 top
R12  53.98,54.93 270 top
R13  61.72,20.57 0 top
R14  9.65,16.26 180 top
R15  9.65,14.22 180 top
R16  26.92,11.43 0 top
R17  37.34,12.7 180 top
R18  37.34,14.99 180 top
R19  48.51,8.38 270 top
R20  65.53,59.69 0 top
R21  67.56,41.15 270 top
R22  70.1,41.15 270 top
R23  68.83,58.42 90 top
R24  65.53,61.21 0 top
R25  57.4,39.88 270 top
R26  61.98,39.88 90 top
R27  66.04,36.83 90 top
R28  81.66,61.72 0 top
R29  58.93,39.88 90 top
R30  60.64,55.88 270 top
R31  70.36,58.42 270 top
R32  74.3,48.51 270 top
R33  55.24,49.53 270 top
R34  80.96,55.88 90 top
R35  90.42,41.15 270 top
R36  92.96,41.15 270 top
R37  89.15,59.44 90 top
R38  101.85,54.1 270 top
R39  80.26,39.88 270 top
R40  84.84,39.88 90 top
R41  90.42,36.83 90 top
R42  103.63,54.1 90 top
R43  81.79,39.88 90 top
R44  83.15,55.88 270 top
R45  90.68,59.44 270 top
R46  97.16,48.51 270 top
R47  78.11,48.51 270 top
R48  23.37,11.43 0 top
R49  51.05,8.38 270 top
RN1  103.63,35.05 180 top
RN2  92.71,30.48 90 top
SJ1  16,7.11 0 top
SJ2  38.61,20.32 0 bottom
SJ3  38.61,16.76 180 bottom
SJ4  67.31,36.83 90 bottom
SJ5  70.36,36.83 90 bottom
SJ6  90.17,36.83 90 bottom
SJ7  93.22,36.83 90 bottom
SW1  109.22,40.89 180 top
VR1  24.13,66.29 0 top
VR2  74.17,66.29 0 top
VR3  100.84,66.29 0 top
XTL1  25.15,7.87 0 top
XTL2  61.47,23.88 0 top
Z1  9.65,12.45 0 top
Z2  9.65,18.03 0 top

### Tracks (layer width: path | path; a pad name or v marks a point on that pad's centre or on a via)
5V  (via drill 0.4, 0.5)
  Top 0.254: R12.2 53.98,54.13 | R38.2 100.33,53.34 | IC6.10 89.25,45.31 88.65,44.7 v88.65,42.67 | v68.83,41.66 68.83,40.39 | 68.83,40.39 R22.2 C24.1 | R21.2 68.83,40.39 | IC5.10 66.39,45.31 65.79,44.7 v65.79,43.18 | IC1.4 65.93,19.41 | IC7.4 v25.91,13.47 v25.91,13.46 | v23.11,13.97 23.11,14.73 23.4,15.01 IC7.32 | R4.2 C39.1 | R19.2 R49.2 C12.1
  Top 0.305: IC4.15 IC4.16 | 53.98,54.13 53.02,53.18 53.02,50.48 52.07,49.53 IC4.16 | IC4.16 C4.1 53.34,43.18 v53.34,40.64 54.86,39.12 R25.2 v57.4,37.85 | v91.69,41.66 91.69,40.39 | 91.69,40.39 R36.2 C35.1 | R35.2 91.69,40.39 | P3.2 111.51,62.23 112.01,61.72 112.01,52.32 P2.2 108.97,52.32 102.36,52.32 101.85,52.83 R38.2 | v80.26,37.34 R39.2 | JP3.1 7.87,51.05 R1.2 R2.2 | R3.2 19.81,54.36 20.32,54.87 LCD1.2 | IC8.8 33.66,29.21 | 33.66,29.21 33.66,25.02 31.75,23.11 25.74,23.11 C39.1 | C41.1 33.74,29.3 33.66,29.21 | R20.2 R24.2 66.36,61.28 v67.55,61.28 | R34.2 79.5,56.64 v77.85,55.24 | R5.2 77.22,16.09 77.22,22.61 75.95,23.88
  Top 0.406: R37.2 89.15,60.96 89.92,61.72 93.98,61.72 94.74,60.96 94.74,58.67 95.25,58.17 97.54,58.17 100.33,55.63 100.33,53.34 100.33,43.69 98.3,41.66 v95.5,41.66 | C5.1 87.02,27.33 IC3.3 84.86,29.49 85.85,30.48 85.85,34.8 84.58,36.07 81.53,36.07 v80.26,37.34 75.95,33.02 75.95,23.88 74.42,22.35 68.07,22.35 65.93,20.21 65.93,20.07 | v25.65,25.15 C39.1 | C12.1 62.9,7.53 63.53,8.16 IC1.18 63.53,16.03 64.33,16.83 IC1.6 64.33,19.63 64.77,20.07 65.93,20.07 | IC1.4 65.93,20.07 | R23.2 68.83,59.69 69.85,60.71 v69.85,61.21 69.85,61.28
  Top 0.61: v25.65,25.15 D1.K 29.22,27.06 Q1.2
  Bottom 0.254: v88.65,42.67 88.65,41.66 | v65.79,43.18 67.31,41.66 v68.83,41.66
  Bottom 0.305: v53.34,40.64 30.73,40.64 20.32,51.05 | v57.4,37.85 60.45,37.85 v65.79,43.18 | VR1.A 26.64,62.26 26.67,62.23
  Bottom 0.406: v95.5,41.66 v91.69,41.66 88.65,41.66 80.26,41.66 | 80.26,41.66 v76.71,41.66 | v80.26,37.34 80.26,41.66 | v76.71,41.66 v68.83,41.66 | v25.91,13.46 23.62,13.46 v23.11,13.97 23.11,22.61 v25.65,25.15 | v67.55,61.28 69.79,61.28 v69.85,61.21 74.17,61.21 75.31,60.07 75.31,56.01 76.07,55.24 v77.85,55.24 77.85,54.23 76.71,53.09 v76.71,41.66
  Bottom 0.61: JP5.2 46.99,67.82 45.97,68.83 36.58,68.83 35.56,67.82 JP4.2 35.56,63.5 34.29,62.23 26.67,62.23 21.33,62.23 20.32,61.21 LCD1.2 20.32,51.05 18.8,49.53 JP3.1 4.57,49.53 3.3,48.26 3.3,38.1 4.83,36.58 JP6.1 14.22,36.58 v25.65,25.15
+3V3  (via drill 0.5)
  Top 0.254: P1.4 105.95,24.64 | 85.43,24.13 C42.1
  Top 0.305: 105.95,24.64 v101.85,24.64 | v92.96,24.13 85.43,24.13 | IC8.2 32.38,38.99 33.02,39.62 39.37,39.62 v45.97,33.02 | v78.99,31.75 81.28,31.75 82.55,30.48 82.55,27.36 IC3.2
  Top 0.406: IC3.2 82.58,24.29 C6.1 82.6,24.22 C42.1
  Bottom 0.305: v101.85,24.64 93.73,24.64 v92.96,24.13 | v45.97,33.02 47.24,31.75 54.1,31.75 54.86,32.51 56.39,32.51 57.15,31.75 v78.99,31.75
+12V  (via drill 0.4)
  Top 0.203: IC5.28 60.55,53.04 | 69.34,53.85 v69.47,53.98 69.34,54.1
  Top 0.254: 83.41,51.22 83.5,51.12 | IC6.15 91.86,53.5 93.73,55.37 | v82.04,57.91 82.04,58.67 C26.1 C25.1
  Top 0.279: 60.55,53.04 59.21,54.37 59.21,59.05
  Top 0.305: IC6.15 91.86,50.58 | IC6.28 83.41,51.22 | 69,50.9 IC5.15 69,53.5 v69.47,53.98 | IC5.28 60.55,50.9 | C14.1 59.56,59.4 59.21,59.05 | R7.2 13.97,54.86 | R6.2 27.6,44.03 26.16,45.47 18.41,45.47 | v58.42,54.61 C15.1
  Top 0.406: 93.73,55.37 96.13,55.37 C8.+ | v69.47,53.98 70.61,55.12 75.23,55.12 C1.+ 75.44,56.9 76.45,57.91 v82.04,57.91 | 82.3,58.93 C26.1
  Top 0.61: 91.86,50.58 v91.76,50.48 | 83.5,51.12 v83.5,50.48 | 69,50.9 v68.58,50.48 | 60.55,50.9 v60.96,50.48 | v58.42,54.61 58.42,60.96 48.77,70.61 21.84,70.61 13.99,62.75 J1.PWR | IC2.6 18.41,45.47 18.41,48.13 20.57,50.29 | 20.57,50.29 21.13,50.29 C7.+ | 13.97,51.96 18.15,51.96 19.81,50.29 20.57,50.29
  Top 0.813: J1.PWR 13.97,54.86 13.97,51.96 12.45,50.43 R8.1
  Bottom 0.406: v83.5,50.48 83.5,56.64 v82.04,57.91
  Bottom 0.61: v60.96,50.48 60.96,53.34 59.69,54.61 v58.42,54.61
  Bottom 0.813: v91.76,50.48 v83.5,50.48 | v68.58,50.48 v60.96,50.48 | v69.47,53.98 68.58,53.09 68.58,50.55
A0
  Top 0.254: IC1.23 67.53,8.67 67.82,8.38 69.09,8.38 70.12,9.41 102.6,9.41 105.66,6.35 108.97,6.35 109.98,7.37 109.98,13.72 J2.1
A1
  Top 0.254: 68.56,9.91 IC1.24 68.33,9.91 102.87,9.91 105.92,6.86 108.71,6.86 109.47,7.62 109.47,11.68 J2.2
A2
  Top 0.254: IC1.25 69.83,11.18 71.12,11.18 71.89,10.41 103.13,10.41 106.17,7.37 108.46,7.37 108.97,7.87 108.97,9.65 J2.3
A3
  Top 0.254: IC1.26 69.86,11.94 71.12,11.94 72.15,10.91 105.17,10.91 J2.4
A4_SDA  (via drill 0.5)
  Top 0.254: v74.42,12.19 73.66,11.43 72.39,11.43 71.05,12.77 IC1.27
  Top 0.305: R19.1 v48.51,11.43
  Bottom 0.254: 48.51,15.24 49.02,15.75 58.93,15.75 61.47,13.21 69.6,13.21 70.36,13.97 73.41,13.97 74.42,12.95 v74.42,12.19
  Bottom 0.305: JP6.2 9.91,30.48 9.91,26.92 16.26,20.57 16.26,10.41 20.83,5.84 46.48,5.84 48.51,7.87 v48.51,11.43 48.51,15.24
A5_SCL  (via drill 0.5)
  Top 0.305: R49.1 v51.05,11.43 | v72.9,12.7 72.03,13.57 IC1.28
  Bottom 0.254: 51.05,14.48 51.56,14.99 58.93,14.99 61.21,12.7 v72.9,12.7
  Bottom 0.305: JP6.3 7.87,31.5 9.14,30.23 9.14,26.67 15.49,20.32 15.49,10.16 20.57,5.08 49.28,5.08 51.05,6.86 v51.05,11.43 51.05,14.48
A6  (via drill 0.5)
  Top 0.305: IC1.19 64.33,7.94 62.99,6.6 56.9,6.6 v55.88,5.59
  Bottom 0.305: JP7.1 9.4,25.4 14.73,20.07 14.73,9.91 20.32,4.32 54.61,4.32 v55.88,5.59
A7  (via drill 0.5)
  Top 0.305: v66.29,3.56 66.73,3.99 IC1.22
  Bottom 0.305: v66.29,3.56 20.07,3.56 13.97,9.65 13.97,19.81 10.92,22.86 JP7.2
AREF
  Top 0.305: IC1.20 65.13,7.13 C9.1
D0_RX  (via drill 0.5)
  Top 0.305: v42.67,14.99 R18.1 | IC1.30 72.07,15.17 v74.17,17.27
  Bottom 0.254: v74.17,17.27 72.39,17.27 71.63,18.03 45.72,18.03 v42.67,14.99
  Bottom 0.305: JP3.2 4.83,45.47 4.83,44.2 5.84,43.18 7.37,43.18 7.87,43.69 23.88,43.69 42.67,24.89 v42.67,14.99
D1_TX  (via drill 0.5)
  Top 0.254: 69.86,16 IC1.31
  Top 0.305: R17.1 42.93,12.7 44.2,13.97 v44.2,18.54 | 69.86,16 71.37,16 72.9,17.53 v72.9,18.54
  Bottom 0.254: v72.9,18.54 v44.2,18.54
  Bottom 0.305: JP3.3 24.13,44.45 42.42,26.16 44.2,24.38 v44.2,18.54
D2  (via drill 0.5)
  Top 0.305: IC5.3 61.84,45.08 v61.47,44.7 | v74.68,20.32 73.15,20.32 71.37,18.54 71.37,17.27 70.87,16.77 IC1.32
  Bottom 0.305: v61.47,44.7 63.5,44.7 64.01,44.2 64.01,42.67 60.71,39.37 56.64,39.37 55.88,38.61 55.88,37.08 53.85,35.05 44.2,35.05 43.43,34.29 43.43,29.21 46.74,25.91 50.29,25.91 52.07,27.69 76.2,27.69 77.22,26.67 77.22,21.84 75.69,20.32 v74.68,20.32
D3  (via drill 0.5)
  Top 0.254: 68.36,18.29 IC1.1
  Top 0.305: IC6.3 84.7,45.08 81.53,41.91 79.5,41.91 78.99,41.4 78.99,38.61 73.41,33.02 v73.41,24.89 | v71.12,20.07 69.34,18.29 68.36,18.29
  Bottom 0.305: v73.41,24.89 73.41,22.35 v71.12,20.07
D4  (via drill 0.5)
  Top 0.305: IC4.1 v52.07,55.63 | v68.33,20.57 67.53,19.78 IC1.2
  Bottom 0.305: v52.07,55.63 52.07,44.7 54.36,42.42 54.36,38.1 52.83,36.58 43.43,36.58 41.91,35.05 41.91,28.19 45.72,24.38 51.31,24.38 52.32,25.4 57.15,25.4 58.67,26.92 66.04,26.92 68.33,24.64 v68.33,20.57
D5  (via drill 0.5)
  Top 0.305: IC5.19 66.39,56.49 v66.55,56.64 | v56.9,26.67 56.9,20.32 60.45,16.77 IC1.9
  Bottom 0.305: v66.55,56.64 66.55,53.59 65.53,52.58 62.99,52.58 59.94,55.63 57.91,55.63 56.13,53.85 56.13,45.47 57.15,44.45 59.44,44.45 59.94,43.94 59.94,40.64 59.44,40.13 56.13,40.13 55.12,39.12 55.12,37.59 53.34,35.81 43.69,35.81 42.67,34.8 42.67,28.7 46.23,25.15 50.8,25.15 52.32,26.67 v56.9,26.67
D6  (via drill 0.5)
  Top 0.254: v88.9,55.37 89.25,54.71 IC6.19
  Top 0.305: IC1.10 60.23,15.97 55.63,20.57 v55.63,31.24
  Bottom 0.254: 92.46,55.37 v88.9,55.37
  Bottom 0.305: v55.63,31.24 75.44,31.24 75.95,30.73 82.55,30.73 84.84,33.02 84.84,38.35 87.12,40.64 96.27,40.64 96.77,41.15 96.77,42.16 96.27,42.67 89.92,42.67 88.9,43.69 88.9,44.7 89.15,44.96 90.42,44.96 90.68,44.7 95.5,44.7 96.27,45.47 96.27,52.32 93.22,55.37 92.46,55.37
D7  (via drill 0.5)
  Top 0.305: IC4.2 v50.8,50.55 | IC1.11 60.01,15.17 54.1,21.08 54.1,33.78 49.53,38.35 v49.53,41.66
  Bottom 0.305: v50.8,50.55 50.8,42.93 v49.53,41.66
D8  (via drill 0.5)
  Top 0.305: IC4.3 v49.53,55.63 | IC1.12 59.8,14.37 53.34,20.83 53.34,33.27 48.26,38.35 v48.26,43.18
  Bottom 0.305: v48.26,43.18 48.26,50.29 48.77,50.8 48.77,54.86 v49.53,55.63
D9  (via drill 0.5)
  Top 0.305: RN2.5 90.75,31.68 v90.17,32.26 | v58.42,13.97 58.78,13.57 IC1.13
  Bottom 0.254: v90.17,32.26 89.15,32.26 88.14,31.24 88.14,29.46 89.66,27.94 89.66,11.68 88.65,10.67 70.36,10.67 68.83,12.19 60.2,12.19 v58.42,13.97
D10_SS  (via drill 0.5)
  Top 0.305: IC1.14 58.1,12.77 57.15,13.72 57.15,16 52.58,20.57 52.58,32.77 39.37,45.97 v39.37,48.26
  Bottom 0.254: 39.37,64.77 v39.37,48.26
  Bottom 0.305: JP4.1 39.37,64.77
D11_MOSI  (via drill 0.5)
  Top 0.254: v58.17,11.68 58.45,11.97
  Top 0.305: RN2.6 89.55,30.88 v89.15,30.48 | 58.45,11.97 IC1.15 | v36.83,48.26 36.83,47.24 51.82,32.26 51.82,20.32 56.39,15.75 56.39,13.46 v58.17,11.68
  Bottom 0.254: P2.4 109.22,49.53 106.93,49.53 106.17,48.77 103.38,48.77 102.36,47.75 102.36,40.13 100.33,38.1 100.33,31.24 99.57,30.48 v89.15,30.48 89.15,29.21 90.17,28.19 90.17,11.43 88.9,10.16 70.1,10.16 68.58,11.68 v58.17,11.68 | 36.83,67.06 v36.83,48.26
  Bottom 0.305: JP5.1 47.24,63.75 42.67,63.75 38.86,67.56 37.34,67.56 36.83,67.06
D12_MISO  (via drill 0.5)
  Top 0.254: v103.89,21.34 105.9,21.34 P1.7
  Top 0.305: IC1.16 60.19,11.17 v59.18,10.16 | P2.1 104.65,50.8 103.89,50.04 v103.89,42.42
  Bottom 0.254: v103.89,21.34 103.89,12.45 100.58,9.14 69.6,9.14 68.58,10.16 v59.18,10.16
  Bottom 0.305: v103.89,42.42 v103.89,21.34
D13_SCK  (via drill 0.5)
  Top 0.254: v61.21,9.14 61.75,9.68 IC1.17
  Top 0.305: RN2.7 91.29,30.08 v90.68,29.46
  Bottom 0.254: v61.21,9.14 58.67,9.14 58.17,9.65 58.17,10.41 58.93,11.18 68.33,11.18 69.85,9.65 89.15,9.65 90.68,11.18 v90.68,29.46 100.08,29.46 100.84,30.23 100.84,37.85 102.87,39.88 102.87,47.5 103.63,48.26 P2.3
DTR  (via drill 0.5)
  Top 0.254: IC7.13 31.75,17.01 35.05,20.32 v36.32,20.32
  Bottom 0.254: SJ2.2 v36.32,20.32
  Bottom 0.305: SJ3.1 SJ2.2
GND  (via drill 0.4, 0.5)
  Top 0.254: R44.1 82.42,56.64 | IC6.7 87.31,48.57 87.63,48.9 | IC6.21 87.95,50.49 87.63,50.16 | 65.09,49.22 IC5.P$1 | 64.77,50.16 64.44,49.84 64.44,48.9 65.09,49.55 | IC1.3 66.73,16.58 66.8,16.51 | IC1.5 65.13,16.66 65.28,16.51 66.55,16.51 | 65.79,11.18 65.93,11.03 IC1.21 65.93,8.02 65.79,7.87 | C18.2 SJ4.1
  Top 0.279: IC5.7 64.44,48.9 | IC5.21 65.09,49.55
  Top 0.305: IC7.3 25.41,15.99 v25.4,16
  Top 0.406: R30.1 61.64,56.64 v62.01,57.18 | v26.92,16 IC7.EXP
  Top 0.61: IC2.4 19.68,39.62
  other vias: 79.88,52.7 81.15,53.09 81.92,52.07 81.92,50.8 80.64,51.44 80.64,50.16 81.92,49.53 81.92,48.26 80.64,48.9 80.64,47.62 80.64,46.35 81.92,45.72 81.92,46.99 93.34,53.34 93.34,52.07 93.34,50.8 93.34,49.53 93.34,48.26 93.34,46.99 93.34,45.72 94.61,50.16 94.61,51.44 94.61,48.9 94.61,47.62 94.61,46.35 83.03,49.21 84.3,49.37 83.82,48.42 90.96,49.37 91.44,48.42 92.23,49.21 57.78,51.44 57.78,52.7 58.93,53.34 59.05,52.07 59.05,50.8 59.05,49.53 57.78,50.16 57.78,48.9 57.78,47.62 57.78,46.35 59.05,48.26 59.05,46.99 59.05,45.72 60.17,49.37 61.44,49.21 60.64,48.42 70.48,50.8 68.02,49.21 68.9,48.5 70.48,49.53 70.48,48.26 70.48,46.99 70.48,45.72 71.75,46.35 71.75,47.62 71.75,48.9 71.75,50.16 71.75,51.44 70.48,52.07 70.74,53.34 71.75,52.7 41.66,54.74 66.23,58.36 92.71,59.94 17.78,40.13 19.05,40.13 21.34,38.86 25.4,17.53 26.92,17.53 67.06,15.24 80.26,25.15 78.99,25.15 78.99,23.88 80.26,23.88 30.73,50.42 71.63,59.44 64.26,33.78 65.53,33.78 66.8,33.78 68.07,33.78 96.77,38.1 96.77,36.58 95.76,37.34 77.22,39.88 77.22,38.61 82.04,37.59 83.31,37.59 55.75,41.66 57.02,34.8 51.44,38.86 45.85,43.69 47.62,33.78 52.45,38.86 58.04,34.8 48.39,33.02 109.73,32.77 108.97,19.56 95.76,26.92 32.13,13.97 40.13,23.37 38.35,35.31 58.67,20.83 48.26,21.59 70.87,25.15 49.78,13.97 16,46.99 20.32,47.24 28.96,65.28 101.85,28.96 69.85,21.08 32.26,29.46 11.94,33.27 31.75,9.65 82.04,7.37 94.61,52.58
  pour Top (isolate 0.406): 3.81,73.66 109.22,73.66 arc-90 113.03,69.85 113.03,3.81 arc-90 109.22,0 3.81,0 arc-90 0,3.81 0,69.85 arc-90
  pour Bottom (isolate 0.406): 3.81,73.66 109.22,73.66 arc-90 113.03,69.85 113.03,3.81 arc-90 109.22,0 3.81,0 arc-90 0,3.81 0,69.85 arc-90
MISO2  (via drill 0.5)
  Top 0.254: IC7.17 31.51,19.06 41.91,29.46 v44.96,29.46
  Bottom 0.254: v44.96,29.46 45.47,29.97 82.8,29.97 87.63,34.8 98.04,34.8 98.3,35.05 98.3,39.12 100.33,41.15 100.33,48.77 102.36,50.8 104.14,50.8 104.9,51.56 104.9,54.1 105.66,54.86 105.66,61.21 106.68,62.23 P3.1
MOSI2  (via drill 0.5)
  Top 0.254: IC7.16 31.72,18.51 41.66,28.45 v45.97,28.45
  Bottom 0.254: v45.97,28.45 46.99,29.46 83.06,29.46 87.88,34.29 98.3,34.29 98.81,34.8 98.81,38.86 100.84,40.89 100.84,48.51 102.62,50.29 104.65,50.29 105.41,51.05 105.41,53.85 106.17,54.61 106.17,59.94 107.19,60.96 109.22,60.96 P3.4
N$1  (via drill 0.4)
  Top 0.279: IC6.11 v89.91,44
  Bottom 0.61: 97.16,52.7 90.48,59.38 JP2.2
  Bottom 0.813: v89.91,44 90.47,43.69 95.89,43.69 97.16,44.96 97.16,52.7
N$3  (via drill 0.4)
  Top 0.279: IC5.4 62.49,43.92
  Top 0.406: 61.72,43.18 62.46,43.92 62.49,43.92
  Top 0.813: v58.71,43.18 61.72,43.18
  Bottom 0.813: v58.71,43.18 56.99,43.18 55.24,44.93 55.24,54.86 57.85,57.47 57.85,65 JP1.4
N$4
  Top 0.254: 87.88,58.17 89.91,56.15 IC6.18
  Top 0.406: 87.88,58.17 87.88,60.96
  Top 0.61: JP2.1 91.44,63.5 88.9,63.5 87.88,62.48 87.88,60.96
N$6
  Top 0.279: 84.61,54.29 84.61,54.13 85.36,53.39 IC6.25
  Top 0.61: 84.61,54.29 84.61,63.53 86.98,65.9 JP2.3
N$7
  Top 0.279: IC6.24 86,53.7 85.72,53.98 C27.2
N$8
  Top 0.279: IC6.23 86.66,55.4 C27.1
N$9  (via drill 0.5)
  Top 0.254: IC6.22 87.31,56.46 v85.85,57.91 | v80.01,60.45 C25.2
  Bottom 0.254: v85.85,57.91 83.31,60.45 v80.01,60.45
N$10
  Top 0.254: IC6.20 88.61,53.63 87.88,54.36 87.88,56.9 87.12,57.66 87.12,58.17 C32.1
N$11
  Top 0.305: IC1.7 63.53,19.61 R13.2 62.57,22.57 XTL2.2 63.88,26.71 C10.2
N$13
  Top 0.305: IC6.1 83.41,45.3
  Top 0.61: 83.41,45.3 82.55,44.45 C34.1 R47.2
N$14
  Top 0.305: IC6.14 91.86,45.78 93.19,44.45
  Top 0.61: 93.19,44.45 C33.1 R46.2
N$15
  Top 0.254: IC6.5 86,42.57 85.34,41.91 83.82,41.91 83.31,41.4 C31.1
  Top 0.305: C31.1 R43.2 R39.1
N$16
  Top 0.254: IC6.6 86.66,42.2 86.36,41.91 C28.1
  Top 0.305: C28.1 R40.2
N$17
  Top 0.279: IC5.24 63.15,53.7 62.87,53.98 62.87,55.05 C16.2
N$18
  Top 0.279: IC5.23 63.8,54.46 C16.1
N$19
  Top 0.279: IC5.16 68.34,54.63
  Top 0.406: 68.34,54.63 70.36,56.64 R31.2
N$20
  Top 0.254: IC6.9 88.61,45.68 87.63,44.7 87.63,42.16 87.88,41.91 87.88,38.61 C29.1 R41.2
N$21
  Top 0.279: IC5.18 67.05,55.46
  Top 0.406: 67.05,55.46 67.82,56.23 67.82,59.94 68.58,60.71 68.58,64.77 JP1.1
N$22  (via drill 0.4)
  Top 0.305: IC5.11 67.05,43.95 v67.06,43.94
  Bottom 0.813: v67.06,43.94 73.03,43.94 74.3,45.21 74.3,52.7 63.81,63.19 JP1.2
N$23
  Top 0.279: IC5.25 62.49,53.55 62.23,53.82 62.23,55.56
  Top 0.457: 62.23,55.56 62.23,55.8 63.5,57.07
  Top 0.61: 63.5,57.07 63.5,60.45 60.31,63.64
  Top 0.813: 60.31,63.64 JP1.3
N$24  (via drill 0.4)
  Top 0.279: IC5.22 64.44,53.49 v64.93,53.98
  Top 0.305: C14.2 61.09,58.99 v60.77,58.67
  Bottom 0.305: v64.93,53.98 64.93,56.48 62.74,58.67 v60.77,58.67
N$25
  Top 0.254: IC5.5 63.15,42.57 62.48,41.91 60.96,41.91 60.45,41.4 C20.1 R29.2 R25.1
N$26
  Top 0.279: IC5.20 65.75,55.1 C21.1
N$27
  Top 0.254: R26.2 C17.1 63.5,41.91 63.8,42.2 IC5.6
N$28
  Top 0.254: IC1.8 62.73,18.71
  Top 0.305: 62.73,18.71 R13.1 60.87,22.06 XTL2.1 59.05,26.71 C11.2
N$29  (via drill 0.5)
  Top 0.305: R3.1 v16.76,54.1 | v7.11,61.21 LED3.A
  Bottom 0.305: v16.76,54.1 9.4,54.1 7.11,56.39 v7.11,61.21
N$30
  Top 0.305: R2.1 6.35,56.64 LED2.A
N$31
  Top 0.305: R1.1 6.6,54.86 LED1.A
N$32
  Top 0.406: 15.8,37.72 IC2.1
  Top 0.813: IC2.8 IC2.7 | IC2.8 IC2.1 | R8.2 14.27,42.75 IC2.8
N$36
  Top 0.254: IC7.1 24.41,12.98 23.88,12.45 22.86,12.45 22.61,12.19 22.61,11.52 R48.1
N$37  (via drill 0.5)
  Top 0.305: Z2.2 v11.94,18.03 | Z1.2 v11.94,12.45 L2.1
  Top 0.813: P4.PIN1 4.24,18.86 P4.TAB1 2.79,18.66 P4.FIX1 v2.79,16.51 v2.79,13.97 P4.FIX2 2.79,11.81 P4.TAB2 4.24,11.62 P4.PIN2
  Bottom 0.305: v11.94,18.03 11.57,17.66 P4.PIN1 | v11.94,12.45 11.57,12.81 P4.PIN2
  Bottom 0.813: v2.79,16.51 v2.79,13.97
N$38
  Top 0.305: P4.D+ 7.79,15.24 R15.2 Z1.1
N$40
  Top 0.305: P4.D- 8.44,15.89 R14.2 Z2.1
N$42
  Top 0.305: R7.1 9.78,54.86 LED4.A
N$43
  Top 0.305: IC2.3 18.29,37.39 C3.1
N$44
  Top 0.305: 19.74,42.93 R9.1 R10.2
  Top 0.508: 19.74,42.93 IC2.5
N$45
  Top 0.61: IC2.2 17.14,35.69 15.75,34.29 L1.P$1 15.75,27.94 14.87,27.06 D2.K
N$46
  Top 0.305: IC5.1 60.55,45.37
  Top 0.61: 60.55,45.37 59.63,44.45 C23.1 R33.2
N$47
  Top 0.305: IC5.14 69,45.81 70.36,44.45
  Top 0.61: 70.36,44.45 C22.1 R32.2
N$48
  Top 0.254: IC5.9 65.75,45.68 64.77,44.7 64.77,42.42 65.02,42.16 65.02,38.61 R27.2 C18.1
N$49  (via drill 0.4)
  Top 0.279: IC5.27 61.2,53.18 59.77,54.61 59.77,57.23 60.09,57.55
  Top 0.305: R20.1 64.71,58.59 v64.53,58.42 | 60.09,57.55 61.1,57.55 62.48,58.93 62.48,59.82 v62.47,59.83
  Bottom 0.305: v62.47,59.83 63.12,59.83 v64.53,58.42
N$50
  Top 0.254: 46.83,53.48 IC4.5
  Top 0.305: LCD1.4 25.39,55.38 25.91,54.86 37.97,54.86 41.78,51.05 45.21,51.05 46.99,52.83 IC4.5
N$51
  Top 0.254: 45.72,52.86 IC4.6
  Top 0.305: LCD1.5 27.93,56.14 28.45,55.63 38.35,55.63 42.16,51.82 44.7,51.82 45.72,52.83 IC4.6
N$52
  Top 0.305: IC4.7 44.45,55.12 43.18,56.39 30.99,56.39 30.48,56.9 LCD1.6
N$53  (via drill 0.4)
  Top 0.305: IC4.11 45.72,49.02 v44.61,50.13
  Bottom 0.305: v44.61,50.13 44.61,54.7 43.18,56.13 LCD1.11
N$54  (via drill 0.4)
  Top 0.305: IC4.12 46.99,49.66 v46.35,50.29
  Bottom 0.305: v46.35,50.29 46.35,55.5 45.72,56.13 LCD1.12
N$55  (via drill 0.4)
  Top 0.305: IC4.13 48.26,50.8 v47.62,51.44
  Bottom 0.305: v47.62,51.44 47.62,55.5 48.26,56.13 LCD1.13
N$56  (via drill 0.5)
  Top 0.305: IC4.14 v49.53,49.53
  Bottom 0.305: v49.53,49.53 49.53,53.85 50.8,55.12 LCD1.14
N$57
  Top 0.279: IC5.17 67.69,54.99
  Top 0.406: 67.69,54.99 68.83,56.13 R23.1
N$58
  Top 0.305: LCD1.3 22.86,62.48 VR1.S
N$59
  Top 0.254: R12.1
  Top 0.305: R12.1 53.34,56.33 LCD1.15
N$60
  Top 0.305: R24.1 61.98,64.01 61.98,67.56 62.74,68.33 69.62,68.33 VR2.E
N$61
  Top 0.305: R28.2 82.42,62.87 78.99,66.29 VR2.A
N$62
  Top 0.305: R11.2 R6.1 29.46,42 29.46,40.89 31.11,39.24 IC8.3
N$63
  Top 0.305: IC8.7 IC8.6 31.11,27.07 Q1.1
N$64  (via drill 0.5)
  Top 0.254: IC5.8 65.09,45.79 64.26,44.96 64.26,42.16 64.52,41.91 C19.1
  Top 0.305: C19.1 63.25,37.59 61.72,36.07 61.72,33.02 62.74,32 69.34,32 75.44,38.1 75.44,44.2 76.2,44.96 76.2,52.07 76.71,52.58 76.71,55.63 77.22,56.13 v77.22,56.9
  Bottom 0.305: VR2.S 77.22,60.71 v77.22,56.9
N$65
  Top 0.279: IC5.26 61.84,53.25 60.64,54.45 R30.2
N$66  (via drill 0.5)
  Top 0.254: IC5.12 67.69,44.83 68.33,44.2 68.33,43.69 67.56,42.93 R21.1 66.8,41.91 66.29,41.4 v66.29,39.62
  Bottom 0.254: v66.29,39.62 66.29,38.61 SJ4.2
N$67  (via drill 0.5)
  Top 0.254: IC5.13 68.34,45.19 70.1,43.43 R22.1 70.87,41.91 71.37,41.4 v71.37,39.62
  Bottom 0.254: v71.37,39.62 71.37,38.61 SJ5.2
N$68
  Top 0.254: IC6.27 84.06,53.1 83.34,53.82 82.71,53.82 82.39,54.13 81.95,54.13 R34.1
N$69
  Top 0.254: IC6.17 90.56,56.51 89.15,57.91 R37.1
N$70
  Top 0.254: R38.1 101.85,55.63
  Top 0.305: 101.85,55.63 99.31,58.17 99.31,62.23 98.32,63.22 VR3.E
N$71
  Top 0.305: R42.2 100.58,57.91 100.58,60.45 103.35,63.22 VR3.A
N$72  (via drill 0.5)
  Top 0.254: IC6.8 87.95,45.79 87.12,44.96 87.12,41.91 87.38,41.66 C30.1
  Top 0.305: v86.11,37.34 87.12,37.34 C30.1
  Bottom 0.305: VR3.S 99.57,62.48 99.57,41.4 98.04,39.88 87.38,39.88 86.11,38.61 v86.11,37.34
N$73
  Top 0.254: IC6.26 84.7,53.25 83.06,54.9 83.19,55.09 R44.2
N$74  (via drill 0.5)
  Top 0.254: IC6.12 90.56,44.83 91.19,44.2 91.19,43.69 90.42,42.93 R35.1
  Top 0.305: R35.1 89.66,41.91 89.15,41.4 v89.15,38.86
  Bottom 0.254: v89.15,38.86 89.15,38.61
  Bottom 0.305: 89.15,38.61 SJ6.2
N$75  (via drill 0.5)
  Top 0.254: IC6.13 91.2,45.19 92.96,43.43 R36.1
  Top 0.305: R36.1 93.73,41.91 94.23,41.4 v94.23,38.86
  Bottom 0.254: v94.23,38.86 94.23,38.61
  Bottom 0.305: 94.23,38.61 SJ7.2
N$76
  Top 0.254: IC6.16 91.2,56.88 90.68,57.4 R45.2
N$77  (via drill 0.4)
  Top 0.279: IC6.4 85.36,43.83
  Top 0.406: 85.36,43.83 v84.71,43.18
  Bottom 0.61: 78.11,44.45 78.11,52.96 79.5,54.36 78.49,61.05 JP2.4
  Bottom 0.813: v84.71,43.18 79.38,43.18 78.11,44.45
N$81
  Top 0.305: IC8.5 29.84,33.91 30.48,34.54 33.02,34.54 33.66,35.18 IC8.1
N$82
  Top 0.254: 105.52,26.92 P1.2
  Top 0.305: 105.52,26.92 104.14,26.92 103.23,27.83 103.23,31.75 | RN1.6 103.23,31.75 | RN2.4 93.45,31.75 103.23,31.75
N$83
  Top 0.254: 105.83,25.65 P1.3 106.07,25.65
  Top 0.305: RN2.3 97.64,30.88 102.87,25.65 105.83,25.65 | RN1.7 104.03,30.84 104.9,29.97 106.68,29.97 107.44,29.21 107.44,26.16 107.07,25.79 P1.3
N$84
  Top 0.254: 105.92,23.62 P1.5 106.24,23.62
  Top 0.305: RN1.8 104.83,31.31 105.41,30.73 107.19,30.73 108.2,29.72 108.2,24.64 107.16,23.59 P1.5 | 105.92,23.62 101.09,23.62 100.33,24.38 100.33,26.92 97.17,30.08 RN2.2
N$87
  Top 0.305: P1.CD1 99.8,21.1 102.87,18.03 111,18.03 111.51,18.54 111.51,35.31 110.49,36.32 CD1.1
N$90  (via drill 0.5)
  Top 0.305: v80.52,15.49 79.16,15.49 C36.1
  Bottom 0.254: SJ3.2 39.37,14.73 40.13,13.97 43.18,13.97 46.74,17.53 71.37,17.53 73.41,15.49 v80.52,15.49
N$113
  Top 0.254: C37.2 27.56,4.79 XTL1.2 27.56,11.21 arc-90 R16.2 27.69,11.52 27.69,12.19 27.43,12.45 25.4,12.45 24.91,12.93 IC7.2
N$114
  Top 0.254: C38.2 22.73,4.79 XTL1.1 24.22,9.36 R48.2 R16.1
N$115
  Top 0.406: P4.VBUS 6.63,16.54 7.11,17.02 7.11,17.27
  Top 0.61: 7.11,17.27 7.11,19.3 8.13,20.32 11.94,20.32 14.73,17.53 15.67,17.53 F1.1
N$117
  Top 0.254: IC7.27 23.13,17.51 21.08,19.56 C40.1
RD+  (via drill 0.5)
  Top 0.254: R15.1 10.67,14.22 11.43,14.99 v18.29,14.99 | v18.8,17.02 19.3,16.51 IC7.29
  Bottom 0.305: v18.29,14.99 v18.8,17.02
RD-
  Top 0.254: IC7.30 10.74,16.01 R14.1
REG_5V
  Top 0.305: R10.1 23.11,35.05 23.5,34.67 C2.1
  Top 0.61: C2.1 D1.A 22.72,31.36 22.35,30.99 22.35,29.76 L1.P$2
RESET
  Top 0.305: P2.5 107.17,44.94 SW1.2 105.14,38.86 101.35,38.86 100.08,37.59 100.08,34.29 99.06,33.27 89.66,33.27 88.14,31.75 88.14,29.97 92.71,25.4 93.47,25.4 94.23,24.64 94.23,23.62 83.73,13.12 C36.2 R5.1 75.02,13.12 73.77,14.37 IC1.29
RESET2  (via drill 0.5)
  Top 0.254: IC7.24 24.41,20.32 | 24.41,20.32 24.41,20.71 R4.1 | 24.41,20.32 32,20.32 42.16,30.48 46.23,30.48 v49.28,27.43
  Bottom 0.254: v49.28,27.43 50.29,28.45 83.57,28.45 88.39,33.27 98.81,33.27 99.82,34.29 99.82,38.35 101.85,40.39 101.85,48.01 103.12,49.28 105.66,49.28 106.43,50.04 106.43,53.34 107.95,54.86 P3.5
RXLED  (via drill 0.5)
  Top 0.254: LED2.C 2.29,56.64 1.78,56.13 1.78,40.64 2.54,39.88 9.4,39.88 v10.16,39.12 | v34.29,16.26 33.55,15.51 IC7.10
  Bottom 0.254: v10.16,39.12 14.48,39.12 25.4,28.19 30.73,28.19 31.75,27.18 31.75,17.53 33.02,16.26 v34.29,16.26
SCK2  (via drill 0.5)
  Top 0.254: IC7.15 31.98,18.01 41.4,27.43 v47.24,27.43
  Bottom 0.254: v47.24,27.43 48.77,28.96 83.31,28.96 88.14,33.78 98.55,33.78 99.31,34.54 99.31,38.61 101.35,40.64 101.35,48.26 102.87,49.78 105.16,49.78 105.92,50.55 105.92,53.59 106.68,54.36 106.68,58.42 P3.3
TXLED  (via drill 0.5)
  Top 0.254: LED1.C 2.79,54.86 2.29,54.36 2.29,40.89 2.79,40.39 9.4,40.39 v10.16,41.15 | v33.53,17.53 32.02,16.01 IC7.11
  Bottom 0.254: v10.16,41.15 11.68,39.62 14.73,39.62 25.65,28.7 30.99,28.7 32.26,27.43 32.26,18.8 v33.53,17.53
USBGND  (via drill 0.5)
  Top 0.254: IC7.28 22.1,17.01 v21.34,17.78
  Top 0.305: v21.34,14.22 17.53,10.41 16.51,10.41 14.22,8.13
  Top 0.406: P4.GND 6.63,13.94 7.11,13.46 7.11,13.21
  Top 0.61: 7.11,13.21 7.11,9.14 8.13,8.13 L2.2 14.22,8.13 SJ1.1
  Bottom 0.305: v21.34,17.78 v21.34,14.22
USBRXD
  Top 0.305: IC7.9 36.46,15.01 R18.2
USBTXD
  Top 0.305: IC7.8 27.91,13.74 28.96,12.7 R17.2
USBVCC  (via drill 0.5)
  Top 0.254: IC7.31 21.1,15.51 v19.68,14.1 | 15.92,13.72 F1.2
  Top 0.61: Q1.3 28.79,24.81 v28.7,24.89 | 15.92,13.72 19.3,13.72 v19.68,14.1
  Bottom 0.61: v28.7,24.89 28.7,13.46 27.43,12.19 21.59,12.19 v19.68,14.1

### Text on the board
tPlace: SERVO1 | SERVO2 | STEPPER 1 | STEPPER 2 | CONTRAST | A1 | A2 | B1 | B2 | MAX CURRENT | A1 | A2 | B1 | B2 | MAX CURRENT | D10 | D11 | 16U2 | ICSP | 12Vdc | 5V | D10 | 5V | D11 | 5V | 12 | RX | TX | 328P | ICSP | UART | +5V | RX | D0 | TX | D1 | GND | I2C | 1 | RESET | +5V | SDA | CD | A4 | SCL | A5 | GND | A6 | A7 | A0 | A1 | A2 | UGND | A3 | 4K7 I2C / PULLUPS | StepDuino Stepper Motor Controller | freetronics | www.freetronics.com/stepduino
bPlace: Select "Arduino Uno" in the IDE | Arduino-compatible | StepDuino | www.freetronics.com/stepduino | STEPPER 1 | STEPPER 2 | MICROSTEP | MICROSTEP | (C) 2013 Freetronics Pty Ltd | Released under | the TAPR Open | MS1 | MS0 | MS1 | MS0 | Hardware License: | www.tapr.org/OHL | UBOOT | RESET-EN | A0: Spare / A1: Spare / A2: Spare / A3: Spare / A4: SDA / Spare / A5: SCL / Spare / A6: Spare / A7: Spare | D0: RX / D1: TX / D2: Stepper 1 Direction / D3: Stepper 2 Direction / D4: LCD Strobe / D5: Stepper 1 Step / D6: Stepper 2 Step / D7: LCD Data / D8: LCD Clock / D9: uSD nCS / D10: SPI SS / D11: SPI MOSI / D12: SPI MISO / D13: SPI SCK | SKU: STEPD | v1.1
tNames: SW1 | L1
tDocu: K | A | K | A | K | A | K | A | + | + | 1 | + | 1 | 1 | 1 | 1 | A | A | K | K | 1 | 1